# EAGLE schematic 10125623A00 (EAGLE 6.4)

## Sheet 1 of 7
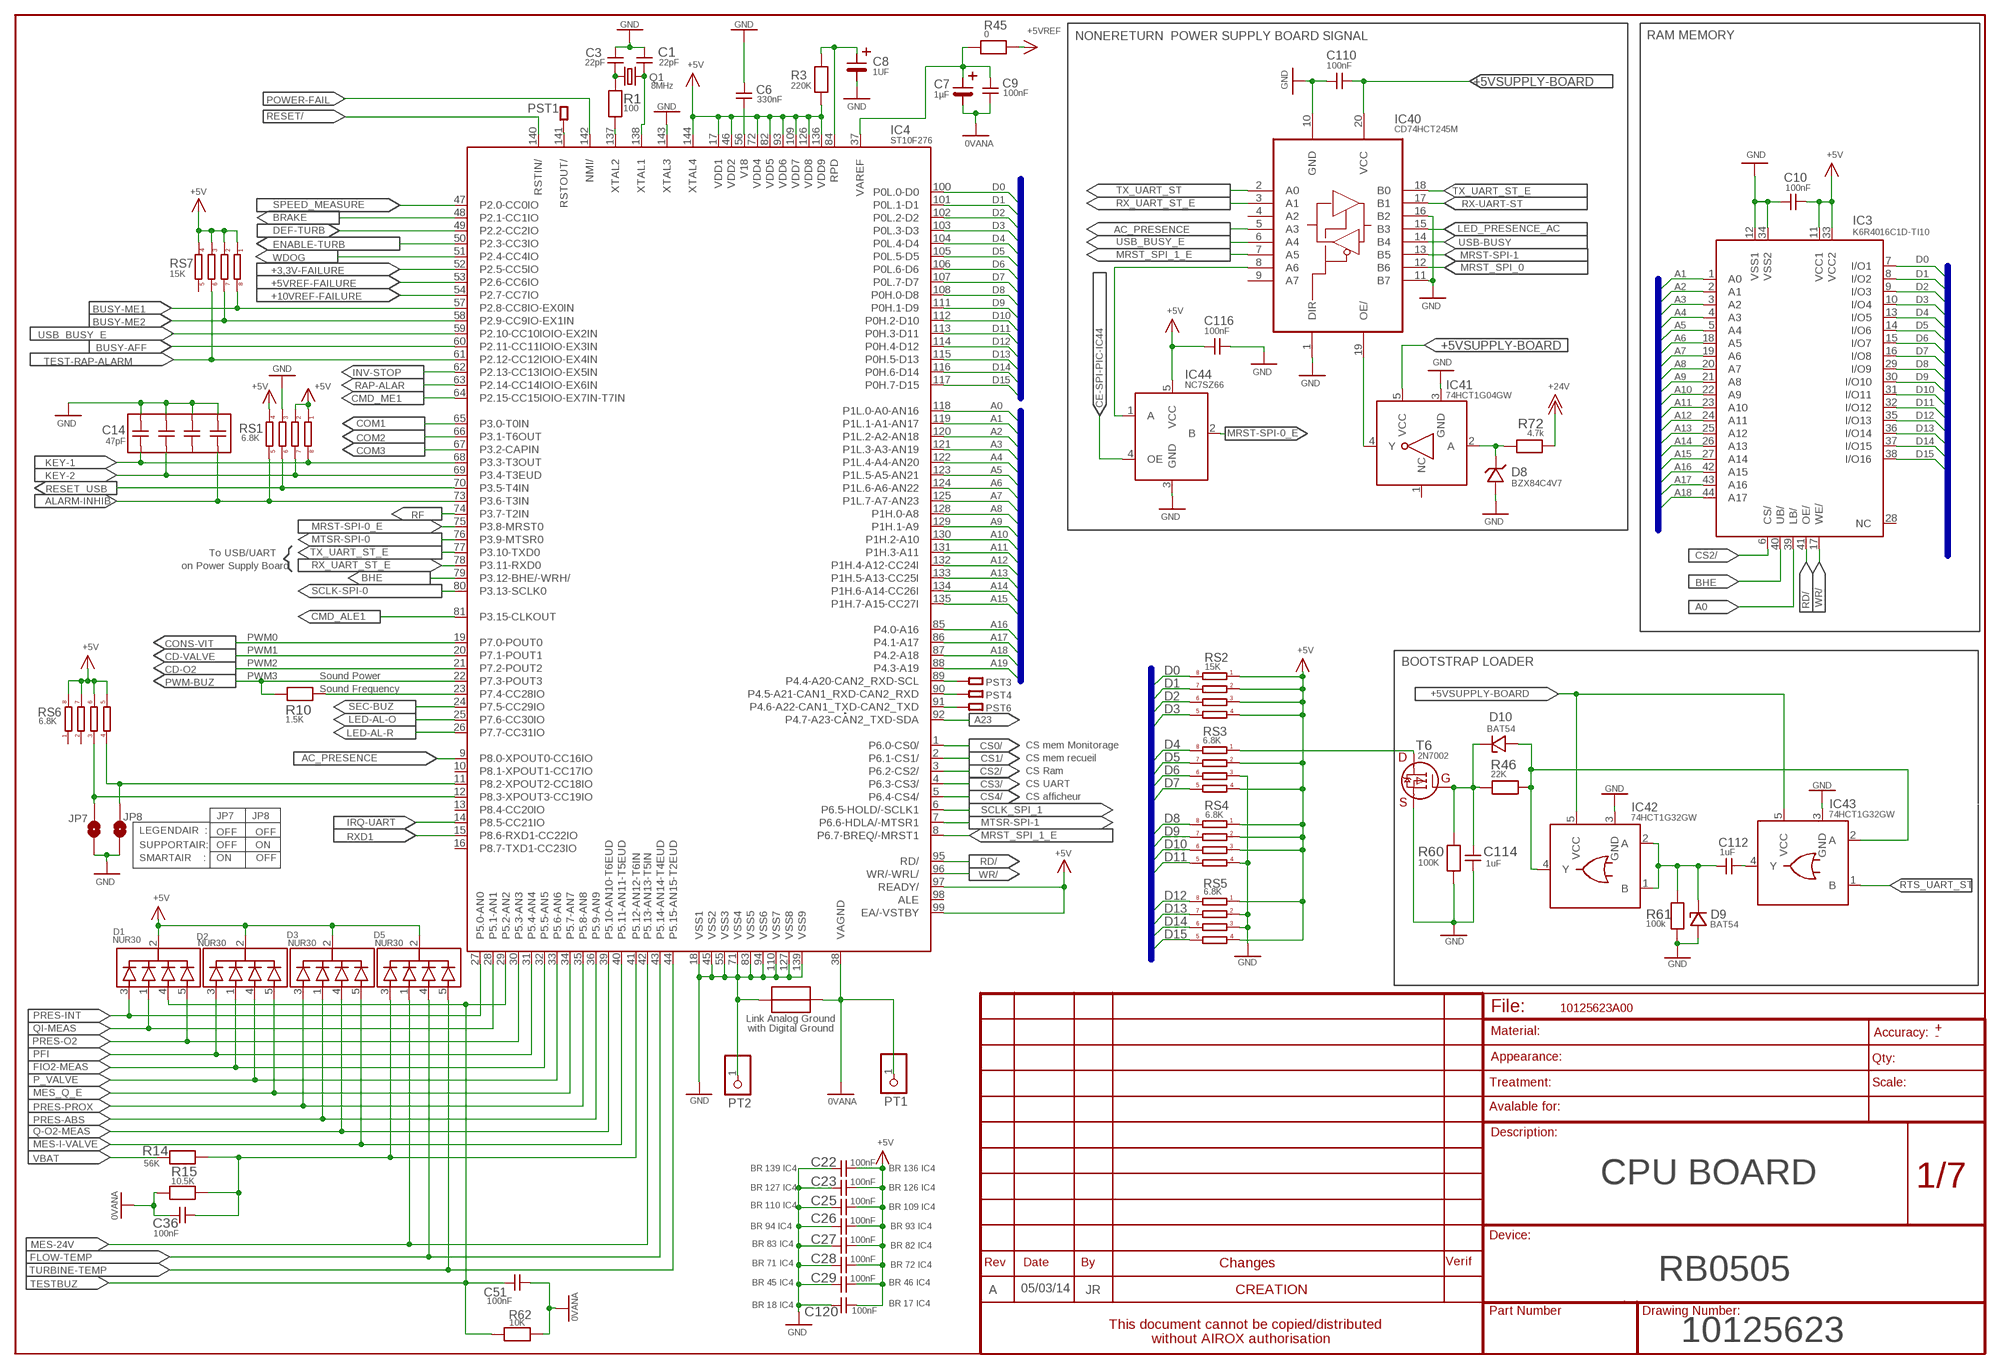
[diagram p0: schematic, sheet 1]

### Parts
C1  22pF  C0603  [C0603]
C3  22pF  C0603  [C0603]
C6  330nF  C0805  [C0805]
C7  1µF  TANTALB  [TANTALB]
C8  1UF  TANTALB  [TANTALB]
C9  100nF  C0805  [C0805]
C10  100nF  C0805  [C0805]
C14  47pF  RES_4CB  [RESEAU2]
C22  100nF  C0805  [C0805]
C23  100nF  C0805  [C0805]
C25  100nF  C0805  [C0805]
C26  100nF  C0805  [C0805]
C27  100nF  C0805  [C0805]
C28  100nF  C0805  [C0805]
C29  100nF  C0805  [C0805]
C36  100nF  C0805  [C0805]
C51  100nF  C0805  [C0805]
C110  100nF  C0805  [C0805]
C112  1uF  C0603  [C0603]
C114  1uF  C0603  [C0603]
C116  100nF  C0805  [C0805]
C120  100nF  C0805  [C0805]
D1  NUR30  [5SOT23]
D2  NUR30  [5SOT23]
D3  NUR30  [5SOT23]
D5  NUR30  [5SOT23]
D8  BZX84C4V7  BZX84CXX  [SOT23DIO]
D9  BAT54  [SOT23DIO]
D10  BAT54  [SOT23DIO]
IC3  K6R4016C1D-TI10  K6R4016C1DTCT000(256KX16)  [TSOPIIZ4]
IC4  ST10F276  ST10F269-273-276  [TQFP144]
IC40  CD74HCT245M  [SO20]
IC41  74HCT1G04GW  [SOT23-5]
IC42  74HCT1G32GW  [SOT23-5]
IC43  74HCT1G32GW  [SOT23-5]
IC44  NC7SZ66  [SOT23-5]
JP7  JUMP_0U  [0805]
JP8  JUMP_0U  [0805]
JPL1  LIAISON_MASSES  [LIAISONS_MASSES]
PST1  PAST01  [1X01]
PST3  PAST01  [1X01]
PST4  PAST01  [1X01]
PST6  PAST01  [1X01]
PT1  PINHD-1X1  [1X01]
PT2  PINHD-1X1  [1X01]
Q1  8MHz  SM49  [SM49]
R1  100  R0805  [R0805]
R3  220K  R0805  [R0805]
R10  1.5K  R0805  [R0805]
R14  56K  R0805  [R0805]
R15  10.5K  R0805  [R0805]
R45  0  R0805  [R0805]
R46  22K  R0805  [R0805]
R60  100K  R0805  [R0805]
R61  100k  R0805  [R0805]
R62  10K  R0805  [R0805]
R72  4.7k  R0805  [R0805]
RS1  6.8K  RES_4R_BCN  [BCN16_4_]
RS2  15K  RES_4R_BCN  [BCN16_4_]
RS3  6.8K  RES_4R_BCN  [BCN16_4_]
RS4  6.8K  RES_4R_BCN  [BCN16_4_]
RS5  6.8K  RES_4R_BCN  [BCN16_4_]
RS6  6.8K  RES_4R_BCN  [BCN16_4_]
RS7  15K  RES_4R_BCN  [BCN16_4_]
T6  2N7002  [SOT23MOS]

### Nets
0VANA: C7.- C9.1 C36.2 C51.2 IC4.38(VAGND) JPL1.2 PT1.1 R15.1 R62.1 ; also sheet 3,4,5,6,7
+3,3V-FAILURE: IC4.52(P2.5-CC5IO) ; also sheet 5
+5V: C10.1 C22.2 C23.2 C25.2 C26.2 C27.2 C28.2 C29.2 C116.2 C120.2 D1.2 D2.2 D3.2 D5.2 IC3.11(VCC1) IC3.33(VCC2) IC4.17(VDD1) IC4.46(VDD2) IC4.72(VDD4) IC4.82(VDD5) IC4.93(VDD6) IC4.97(READY/) IC4.99(EA/-VSTBY) IC4.109(VDD7) IC4.126(VDD8) IC4.136(VDD9) IC4.144(XTAL4) IC44.5(VCC) R3.2 RS1.1 RS1.2 RS1.4 RS2.1 RS2.2 RS2.3 RS2.4 RS3.2 RS3.4 RS4.1 RS4.2 RS4.3 RS5.1 RS5.4 RS6.5 RS6.6 RS6.7 RS6.8 RS7.1 RS7.2 RS7.3 RS7.4 ; also sheet 2,3,5,6,7
+5VREF: R45.2 ; also sheet 4,5,6
+5VREF-FAILURE: IC4.53(P2.6-CC6IO) ; also sheet 5
+5VSUPPLY-BOARD: C110.1 IC40.20(VCC) IC41.5(VCC) IC42.5(VCC) IC43.5(VCC) ; also sheet 6,7
+10VREF-FAILURE: IC4.54(P2.7-CC7IO) ; also sheet 5
+24V: R72.1 ; also sheet 3,5,6,7
A0: IC3.39(LB/) IC4.118(P1L.0-A0-AN16) ; also sheet 2,7
A1: IC3.1(A0) IC4.119(P1L.1-A1-AN17) ; also sheet 2,7
A2: IC3.2(A1) IC4.120(P1L.2-A2-AN18) ; also sheet 2,7
A3: IC3.3(A2) IC4.121(P1L.3-A3-AN19) ; also sheet 2,7
A4: IC3.4(A3) IC4.122(P1L.4-A4-AN20) ; also sheet 2
A5: IC3.5(A4) IC4.123(P1L.5-A5-AN21) ; also sheet 2
A6: IC3.18(A5) IC4.124(P1L.6-A6-AN22) ; also sheet 2
A7: IC3.19(A6) IC4.125(P1L.7-A7-AN23) ; also sheet 2
A8: IC3.20(A7) IC4.128(P1H.0-A8) ; also sheet 2
A9: IC3.21(A8) IC4.129(P1H.1-A9) ; also sheet 2
A10: IC3.22(A9) IC4.130(P1H.2-A10) ; also sheet 2
A11: IC3.23(A10) IC4.131(P1H.3-A11) ; also sheet 2
A12: IC3.24(A11) IC4.132(P1H.4-A12-CC24I) ; also sheet 2
A13: IC3.25(A12) IC4.133(P1H.5-A13-CC25I) ; also sheet 2
A14: IC3.26(A13) IC4.134(P1H.6-A14-CC26I) ; also sheet 2
A15: IC3.27(A14) IC4.135(P1H.7-A15-CC27I) ; also sheet 2
A16: IC3.42(A15) IC4.85(P4.0-A16) ; also sheet 2
A17: IC3.43(A16) IC4.86(P4.1-A17) ; also sheet 2
A18: IC3.44(A17) IC4.87(P4.2-A18) ; also sheet 2
A19: IC4.88(P4.3-A19) ; also sheet 2
A23: IC4.92(P4.7-A23-CAN2_TXD-SDA) ; also sheet 2
AC_PRESENCE: IC4.9(P8.0-XPOUT0-CC16IO) IC40.5(A3)
ALARM-INHIB: C14.8 IC4.73(P3.6-T3IN) RS1.5 ; also sheet 7
BHE: IC3.40(UB/) IC4.79(P3.12-BHE/-WRH/)
BLOAD: RS3.1 T6.D
BRAKE: IC4.48(P2.1-CC1IO) ; also sheet 6
BUSY-AFF: IC4.60(P2.11-CC11IOIO-EX3IN) ; also sheet 7
BUSY-ME1: IC4.57(P2.8-CC8IO-EX0IN) RS7.8 ; also sheet 2
BUSY-ME2: IC4.58(P2.9-CC9IO-EX1IN) RS7.7 ; also sheet 2
CD-O2: IC4.21(P7.2-POUT2) ; also sheet 3
CD-VALVE: IC4.20(P7.1-POUT1) ; also sheet 3
CE-SPI-PIC-IC44: IC44.4(OE) ; also sheet 2
CMD_ALE1: IC4.81(P3.15-CLKOUT) ; also sheet 2
CMD_ME1: IC4.64(P2.15-CC15IOIO-EX7IN-T7IN) ; also sheet 2
COM1: IC4.65(P3.0-T0IN) ; also sheet 7
COM2: IC4.66(P3.1-T6OUT) ; also sheet 7
COM3: IC4.67(P3.2-CAPIN) ; also sheet 7
CONS-VIT: IC4.19(P7.0-POUT0) ; also sheet 6
CS0/: IC4.1(P6.0-CS0/) ; also sheet 2
CS1/: IC4.2(P6.1-CS1/) ; also sheet 2
CS2/: IC3.6(CS/) IC4.3(P6.2-CS2/)
CS3/: IC4.4(P6.3-CS3/) ; also sheet 2
CS4/: IC4.5(P6.4-CS4/) ; also sheet 7
D0: IC3.7(I/O1) IC4.100(P0L.0-D0) RS2.8 ; also sheet 2,7
D1: IC3.8(I/O2) IC4.101(P0L.1-D1) RS2.7 ; also sheet 2,7
D2: IC3.9(I/O3) IC4.102(P0L.2-D2) RS2.6 ; also sheet 2,7
D3: IC3.10(I/O4) IC4.103(P0L.3-D3) RS2.5 ; also sheet 2,7
D4: IC3.13(I/O5) IC4.104(P0L.4-D4) RS3.8 ; also sheet 2,7
D5: IC3.14(I/O6) IC4.105(P0L.5-D5) RS3.7 ; also sheet 2,7
D6: IC3.15(I/O7) IC4.106(P0L.6-D6) RS3.6 ; also sheet 2,7
D7: IC3.16(I/O8) IC4.107(P0L.7-D7) RS3.5 ; also sheet 2,7
D8: IC3.29(I/O9) IC4.108(P0H.0-D8) RS4.8 ; also sheet 2
D9: IC3.30(I/O10) IC4.111(P0H.1-D9) RS4.7 ; also sheet 2
D10: IC3.31(I/O11) IC4.112(P0H.2-D10) RS4.6 ; also sheet 2
D11: IC3.32(I/O12) IC4.113(P0H.3-D11) RS4.5 ; also sheet 2
D12: IC3.35(I/O13) IC4.114(P0H.4-D12) RS5.8 ; also sheet 2
D13: IC3.36(I/O14) IC4.115(P0H.5-D13) RS5.7 ; also sheet 2
D14: IC3.37(I/O15) IC4.116(P0H.6-D14) RS5.6 ; also sheet 2
D15: IC3.38(I/O16) IC4.117(P0H.7-D15) RS5.5 ; also sheet 2
DEF-TURB: IC4.49(P2.2-CC2IO) ; also sheet 6
ENABLE-TURB: IC4.50(P2.3-CC3IO) ; also sheet 6
FIO2-MEAS: D2.1 IC4.32(P5.5-AN5) ; also sheet 3
FLOW-TEMP: D5.4 IC4.43(P5.14-AN14-T4EUD) ; also sheet 6
GND: C1.2 C3.2 C6.2 C8.- C10.2 C14.1 C14.2 C14.3 C14.4 C22.1 C23.1 C25.1 C26.1 C27.1 C28.1 C29.1 C110.2 C114.1 C116.1 C120.1 D8.1(A) D9.1(A) IC3.12(VSS1) IC3.34(VSS2) IC4.18(VSS1) IC4.45(VSS2) IC4.55(VSS3) IC4.71(VSS4) IC4.83(VSS5) IC4.94(VSS6) IC4.110(VSS7) IC4.127(VSS8) IC4.139(VSS9) IC4.143(XTAL3) IC40.1(DIR) IC40.10(GND) IC40.11(B7) IC40.16(B2) IC41.3(GND) IC42.3(GND) IC43.3(GND) IC44.3(GND) JP7.1 JP8.1 JPL1.1 PT2.1 R60.1 R61.2 RS1.3 RS3.3 RS4.4 RS5.2 RS5.3 T6.S ; also sheet 2,3,5,6,7
INV-STOP: IC4.62(P2.13-CC13IOIO-EX5IN) ; also sheet 6
IRQ-UART: IC4.14(P8.5-CC21IO) ; also sheet 2
KEY-1: C14.5 IC4.68(P3.3-T3OUT) RS1.8 ; also sheet 7
KEY-2: C14.6 IC4.69(P3.4-T3EUD) RS1.7 ; also sheet 7
LED-AL-O: IC4.25(P7.6-CC30IO) ; also sheet 7
LED-AL-R: IC4.26(P7.7-CC31IO) ; also sheet 7
LED_PRESENCE_AC: IC40.15(B3) ; also sheet 7
MES-24V: D5.1 IC4.42(P5.13-AN13-T5IN) ; also sheet 5
MES-I-VALVE: D3.5 IC4.40(P5.11-AN11-T5EUD) ; also sheet 3
MES_Q_E: D2.5 IC4.34(P5.7-AN7) ; also sheet 4
MRST-SPI-0_E: IC4.75(P3.8-MRST0) IC44.2(B) ; also sheet 2,3,4
MRST-SPI-1: IC40.13(B5) ; also sheet 7
MRST_SPI_0: IC40.12(B6) ; also sheet 7
MRST_SPI_1_E: IC4.8(P6.7-BREQ/-MRST1) IC40.7(A5)
MTSR-SPI-0: IC4.76(P3.9-MTSR0) ; also sheet 2,3,4,7
MTSR-SPI-1: IC4.7(P6.6-HDLA/-MTSR1) ; also sheet 7
N$3: C3.1 Q1.1 R1.1
N$4: IC4.137(XTAL2) R1.2
N$11: C8.+ IC4.84(RPD) R3.1
N$20: IC4.23(P7.4-CC28IO) R10.2
N$41: IC4.141(RSTOUT/) PST1.1
N$55: IC4.89(P4.4-A20-CAN2_RXD-SCL) PST3.1
N$56: IC4.90(P4.5-A21-CAN1_RXD-CAN2_RXD) PST4.1
N$57: IC4.91(P4.6-A22-CAN1_TXD-CAN2_TXD) PST6.1
N$64: C7.+ C9.2 IC4.37(VAREF) R45.1
N$76: C1.1 IC4.138(XTAL1) Q1.2
N$84: IC4.11(P8.2-XPOUT2-CC18IO) JP8.2 RS6.4
N$86: C36.1 D5.3 IC4.41(P5.12-AN12-T6IN) R14.2 R15.2
N$88: IC4.12(P8.3-XPOUT3-CC19IO) JP7.2 RS6.3
N$92: D10.1(A) IC42.4(Y) IC43.2(A) R46.2
N$96: IC40.19(OE/) IC41.4(Y)
N$99: D8.3(K) IC41.2(A) R72.2
N$100: C112.2 IC43.4(Y)
N$102: C112.1 D9.3(K) IC42.1(B) IC42.2(A) R61.1
N$106: IC40.8(A6) IC44.1(A)
N$111: C6.1 IC4.56(V18)
N$121: C114.2 D10.3(K) R46.1 R60.2 T6.G
P_VALVE: D2.4 IC4.33(P5.6-AN6) ; also sheet 4
PFI: D2.3 IC4.31(P5.4-AN4) ; also sheet 3
POWER-FAIL: IC4.142(NMI/) ; also sheet 3
PRES-ABS: D3.1 IC4.36(P5.9-AN9) ; also sheet 4
PRES-INT: D1.3 IC4.27(P5.0-AN0) ; also sheet 4
PRES-O2: D1.5 IC4.30(P5.3-AN3) ; also sheet 4
PRES-PROX: D3.3 IC4.35(P5.8-AN8) ; also sheet 4
PWM-BUZ: IC4.22(P7.3-POUT3) R10.1 ; also sheet 6
Q-O2-MEAS: D3.4 IC4.39(P5.10-AN10-T6EUD) ; also sheet 6
QI-MEAS: D1.1 IC4.28(P5.1-AN1) ; also sheet 4
RAP-ALAR: IC4.63(P2.14-CC14IOIO-EX6IN) ; also sheet 6
RD/: IC3.41(OE/) IC4.95(RD/) ; also sheet 2,7
RESET/: IC4.140(RSTIN/) ; also sheet 2,3
RESET_USB: IC4.70(P3.5-T4IN) RS1.6 ; also sheet 7
RF: IC4.74(P3.7-T2IN) ; also sheet 6
RTS_UART_ST: IC43.1(B) ; also sheet 7
RX-UART-ST: IC40.17(B1) ; also sheet 7
RX_UART_ST_E: IC4.78(P3.11-RXD0) IC40.3(A1)
RXD1: IC4.15(P8.6-RXD1-CC22IO) ; also sheet 7
SCLK-SPI-0: IC4.80(P3.13-SCLK0) ; also sheet 2,3,4,7
SCLK_SPI_1: IC4.6(P6.5-HOLD/-SCLK1) ; also sheet 7
SEC-BUZ: IC4.24(P7.5-CC29IO) ; also sheet 3
SPEED_MEASURE: IC4.47(P2.0-CC0IO) ; also sheet 6
TEST-RAP-ALARM: IC4.61(P2.12-CC12IOIO-EX4IN) RS7.6 ; also sheet 6
TESTBUZ: C51.1 D1.4 IC4.29(P5.2-AN2) R62.2 ; also sheet 6
TURBINE-TEMP: D5.5 IC4.44(P5.15-AN15-T2EUD) ; also sheet 6
TX_UART_ST: IC40.2(A0) ; also sheet 7
TX_UART_ST_E: IC4.77(P3.10-TXD0) IC40.18(B0)
USB-BUSY: IC40.14(B4) ; also sheet 7
USB_BUSY_E: IC4.59(P2.10-CC10IOIO-EX2IN) IC40.6(A4)
VBAT: R14.1 ; also sheet 7
WDOG: IC4.51(P2.4-CC4IO) ; also sheet 3
WR/: IC3.17(WE/) IC4.96(WR/-WRL/) ; also sheet 2,7
Unconnected: C14.7 IC3.28(NC) IC4.10(P8.1-XPOUT1-CC17IO) IC4.13(P8.4-CC20IO) IC4.16(P8.7-TXD1-CC23IO) IC4.98(ALE) IC40.4(A2) IC40.9(A7) IC41.1(NC) RS6.1 RS6.2 RS7.5

### Buses
D[0..15]
A[0..23]

### Notes on the sheet
- NONERETURN  POWER SUPPLY BOARD SIGNAL | RAM MEMORY
- To USB/UART
- on Power Supply Board
- PWM0
- PWM1
- PWM2 | BOOTSTRAP LOADER
- PWM3 | Sound Power
- Sound Frequency
- CS mem Monitorage
- CS mem recueil
- CS Ram
- CS UART
- CS afficheur
- JP7      JP8
- LEGENDAIR  : | OFF      OFF
- SUPPORTAIR: | OFF      ON
- SMARTAIR    : | ON        OFF
- Link Analog Ground
- with Digital Ground
- BR 139 IC4 | BR 136 IC4
- CPU BOARD
- BR 127 IC4 | BR 126 IC4
- BR 110 IC4 | BR 109 IC4
- BR 94 IC4 | BR 93 IC4
- BR 83 IC4 | BR 82 IC4
- BR 71 IC4 | BR 72 IC4
- RB0505
- BR 45 IC4 | BR 46 IC4
- A | 05/03/14 | JR
- BR 18 IC4 | BR 17 IC4
- 10125623

## Sheet 2 of 7
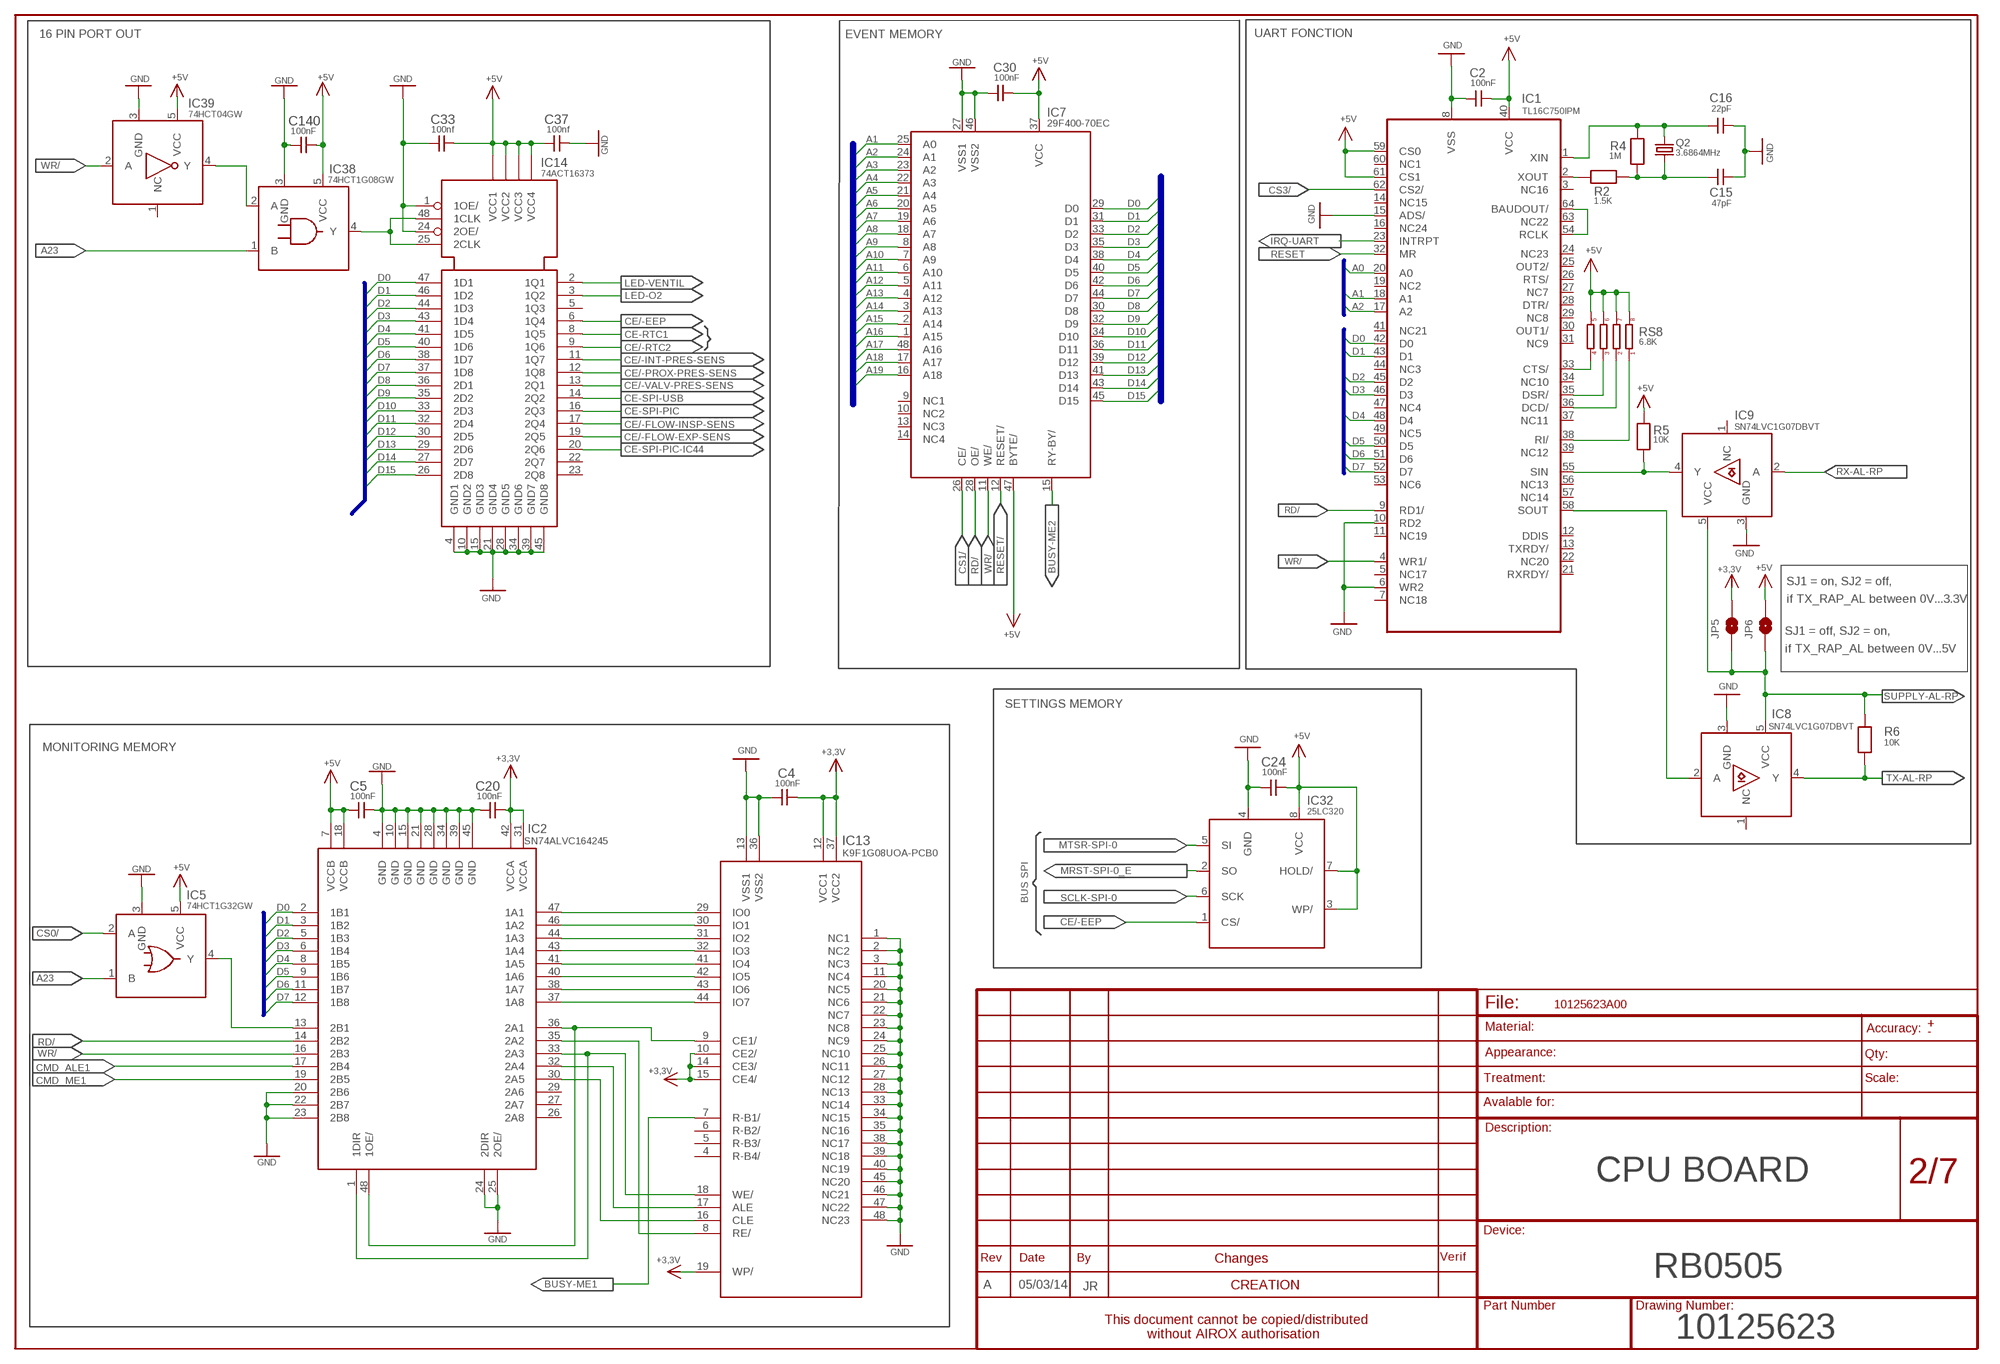
[diagram p1: schematic, sheet 2]

### Parts
C2  100nF  C0805  [C0805]
C4  100nF  C0805  [C0805]
C5  100nF  C0603  [C0603]
C15  47pF  C0805  [C0805]
C16  22pF  C0805  [C0805]
C20  100nF  C0603  [C0603]
C24  100nF  C0805  [C0805]
C30  100nF  C0805  [C0805]
C33  100nf  C0805  [C0805]
C37  100nf  C0805  [C0805]
C140  100nF  C0805  [C0805]
IC1  TL16C750IPM  [TQFP64]
IC2  SN74ALVC164245  [TSSOP48]
IC5  74HCT1G32GW  [SOT23-5]
IC7  Am29F400-EC  29F800  [TS048]
IC8  SN74LVC1G07DBVT  LVC1G07DBVT  [SOT753_DBV]
IC9  SN74LVC1G07DBVT  LVC1G07DBVT  [SOT753_DBV]
IC13  K9F1G08UOA-PCB0  K9F4G08U0M-PCB000  [TS048]
IC14  74ACT16373  [TSSOP48]
IC32  25LC320  AT25---  [SOIC8]
IC38  74HCT1G08GW  [SOT23-5]
IC39  74HCT04GW  74HCT1G04GW  [SOT23-5]
JP5  JUMP_0U  [0805]
JP6  JUMP_0U  [0805]
Q2  3.6864MHz  HC49UP  [HC49UP]
R2  1.5K  R0805  [R0805]
R4  1M  R0805  [R0805]
R5  10K  R0805  [R0805]
R6  10K  R0805  [R0805]
RS8  6.8K  RES_4R_BCN  [BCN16_4_]

### Nets
+3,3V: C4.1 C20.1 IC2.31(VCCA) IC2.42(VCCA) IC13.10(CE2/) IC13.12(VCC1) IC13.14(CE3/) IC13.15(CE4/) IC13.19(WP/) IC13.37(VCC2) JP5.2 ; also sheet 5,6,7
+5V: C2.1 C5.2 C24.1 C30.1 C33.1 C37.2 C140.2 IC1.40(VCC) IC1.59(CS0) IC1.61(CS1) IC2.7(VCCB) IC2.18(VCCB) IC5.5(VCC) IC7.37(VCC) IC7.47(BYTE/) IC14.7(VCC1) IC14.18(VCC2) IC14.31(VCC3) IC14.42(VCC4) IC32.3(WP/) IC32.7(HOLD/) IC32.8(VCC) IC38.5(VCC) IC39.5(VCC) JP6.2 R5.2 RS8.5 RS8.6 RS8.7 RS8.8 ; also sheet 1,3,5,6,7
A0: IC1.20(A0) ; also sheet 1,7
A1: IC1.18(A1) IC7.25(A0) ; also sheet 1,7
A2: IC1.17(A2) IC7.24(A1) ; also sheet 1,7
A3: IC7.23(A2) ; also sheet 1,7
A4: IC7.22(A3) ; also sheet 1
A5: IC7.21(A4) ; also sheet 1
A6: IC7.20(A5) ; also sheet 1
A7: IC7.19(A6) ; also sheet 1
A8: IC7.18(A7) ; also sheet 1
A9: IC7.8(A8) ; also sheet 1
A10: IC7.7(A9) ; also sheet 1
A11: IC7.6(A10) ; also sheet 1
A12: IC7.5(A11) ; also sheet 1
A13: IC7.4(A12) ; also sheet 1
A14: IC7.3(A13) ; also sheet 1
A15: IC7.2(A14) ; also sheet 1
A16: IC7.1(A15) ; also sheet 1
A17: IC7.48(A16) ; also sheet 1
A18: IC7.17(A17) ; also sheet 1
A19: IC7.16(A18) ; also sheet 1
A23: IC5.1(B) IC38.1(B) ; also sheet 1
BUSY-ME1: IC13.7(R-B1/) ; also sheet 1
BUSY-ME2: IC7.15(RY-BY/) ; also sheet 1
CE-RTC1: IC14.8(1Q5) ; also sheet 3
CE-SPI-PIC: IC14.16(2Q3) ; also sheet 7
CE-SPI-PIC-IC44: IC14.20(2Q6) ; also sheet 1
CE-SPI-USB: IC14.14(2Q2) ; also sheet 7
CE/-EEP: IC14.6(1Q4) IC32.1(CS/)
CE/-FLOW-EXP-SENS: IC14.19(2Q5) ; also sheet 4
CE/-FLOW-INSP-SENS: IC14.17(2Q4) ; also sheet 4
CE/-INT-PRES-SENS: IC14.11(1Q7) ; also sheet 4
CE/-PROX-PRES-SENS: IC14.12(1Q8) ; also sheet 4
CE/-RTC2: IC14.9(1Q6) ; also sheet 3
CE/-VALV-PRES-SENS: IC14.13(2Q1) ; also sheet 4
CMD_ALE1: IC2.17(2B4) ; also sheet 1
CMD_ME1: IC2.19(2B5) ; also sheet 1
CS0/: IC5.2(A) ; also sheet 1
CS1/: IC7.26(CE/) ; also sheet 1
CS3/: IC1.62(CS2/) ; also sheet 1
D0: IC1.42(D0) IC2.2(1B1) IC7.29(D0) IC14.47(1D1) ; also sheet 1,7
D1: IC1.43(D1) IC2.3(1B2) IC7.31(D1) IC14.46(1D2) ; also sheet 1,7
D2: IC1.45(D2) IC2.5(1B3) IC7.33(D2) IC14.44(1D3) ; also sheet 1,7
D3: IC1.46(D3) IC2.6(1B4) IC7.35(D3) IC14.43(1D4) ; also sheet 1,7
D4: IC1.48(D4) IC2.8(1B5) IC7.38(D4) IC14.41(1D5) ; also sheet 1,7
D5: IC1.50(D5) IC2.9(1B6) IC7.40(D5) IC14.40(1D6) ; also sheet 1,7
D6: IC1.51(D6) IC2.11(1B7) IC7.42(D6) IC14.38(1D7) ; also sheet 1,7
D7: IC1.52(D7) IC2.12(1B8) IC7.44(D7) IC14.37(1D8) ; also sheet 1,7
D8: IC7.30(D8) IC14.36(2D1) ; also sheet 1
D9: IC7.32(D9) IC14.35(2D2) ; also sheet 1
D10: IC7.34(D10) IC14.33(2D3) ; also sheet 1
D11: IC7.36(D11) IC14.32(2D4) ; also sheet 1
D12: IC7.39(D12) IC14.30(2D5) ; also sheet 1
D13: IC7.41(D13) IC14.29(2D6) ; also sheet 1
D14: IC7.43(D14) IC14.27(2D7) ; also sheet 1
D15: IC7.45(D15) IC14.26(2D8) ; also sheet 1
GND: C2.2 C4.2 C5.1 C15.2 C16.1 C20.2 C24.2 C30.2 C33.2 C37.1 C140.1 IC1.6(WR2) IC1.8(VSS) IC1.10(RD2) IC1.15(ADS/) IC2.4(GND) IC2.10(GND) IC2.15(GND) IC2.20(2B6) IC2.21(GND) IC2.22(2B7) IC2.23(2B8) IC2.24(2DIR) IC2.25(2OE/) IC2.28(GND) IC2.34(GND) IC2.39(GND) IC2.45(GND) IC5.3(GND) IC7.27(VSS1) IC7.46(VSS2) IC8.3(GND) IC9.3(GND) IC13.1(NC1) IC13.2(NC2) IC13.3(NC3) IC13.11(NC4) IC13.13(VSS1) IC13.20(NC5) IC13.21(NC6) IC13.22(NC7) IC13.23(NC8) IC13.24(NC9) IC13.25(NC10) IC13.26(NC11) IC13.27(NC12) IC13.28(NC13) IC13.33(NC14) IC13.34(NC15) IC13.35(NC16) IC13.36(VSS2) IC13.38(NC17) IC13.39(NC18) IC13.40(NC19) IC13.45(NC20) IC13.46(NC21) IC13.47(NC22) IC13.48(NC23) IC14.1(1OE/) IC14.4(GND1) IC14.10(GND2) IC14.15(GND3) IC14.21(GND4) IC14.24(2OE/) IC14.28(GND5) IC14.34(GND6) IC14.39(GND7) IC14.45(GND8) IC32.4(GND) IC38.3(GND) IC39.3(GND) ; also sheet 1,3,5,6,7
IRQ-UART: IC1.23(INTRPT) ; also sheet 1
LED-O2: IC14.3(1Q2) ; also sheet 7
LED-VENTIL: IC14.2(1Q1) ; also sheet 7
MRST-SPI-0_E: IC32.2(SO) ; also sheet 1,3,4
MTSR-SPI-0: IC32.5(SI) ; also sheet 1,3,4,7
N$8: IC2.47(1A1) IC13.29(IO0)
N$10: IC38.2(A) IC39.4(Y)
N$12: C16.2 IC1.1(XIN) Q2.1 R4.2
N$13: IC2.13(2B1) IC5.4(Y)
N$14: IC14.25(2CLK) IC14.48(1CLK) IC38.4(Y)
N$27: C15.1 Q2.2 R2.2 R4.1
N$29: IC1.2(XOUT) R2.1
N$31: IC1.54(RCLK) IC1.64(BAUDOUT/)
N$35: IC2.36(2A1) IC2.48(1OE/) IC13.9(CE1/)
N$53: IC2.46(1A2) IC13.30(IO1)
N$63: IC2.44(1A3) IC13.31(IO2)
N$65: IC2.43(1A4) IC13.32(IO3)
N$69: IC1.33(CTS/) RS8.4
N$73: IC1.35(DSR/) RS8.3
N$74: IC1.36(DCD/) RS8.2
N$77: IC1.38(RI/) RS8.1
N$79: IC1.58(SOUT) IC8.2(A)
N$80: IC2.41(1A5) IC13.41(IO4)
N$85: IC2.40(1A6) IC13.42(IO5)
N$89: IC2.35(2A2) IC13.8(RE/)
N$90: IC2.32(2A4) IC13.17(ALE)
N$91: IC2.30(2A5) IC13.16(CLE)
N$94: IC2.38(1A7) IC13.43(IO6)
N$95: IC2.37(1A8) IC13.44(IO7)
N$101: IC2.1(1DIR) IC2.33(2A3) IC13.18(WE/)
RD/: IC1.9(RD1/) IC2.14(2B2) IC7.28(OE/) ; also sheet 1,7
RESET: IC1.32(MR) ; also sheet 3
RESET/: IC7.12(RESET/) ; also sheet 1,3
RX-AL-RP: IC9.2(A) ; also sheet 6
RXD2: IC1.55(SIN) IC9.4(Y) R5.1
SCLK-SPI-0: IC32.6(SCK) ; also sheet 1,3,4,7
SUPPLY-AL-RP: IC8.5(VCC) IC9.5(VCC) JP5.1 JP6.1 R6.2 ; also sheet 6
TX-AL-RP: IC8.4(Y) R6.1 ; also sheet 6
WR/: IC1.4(WR1/) IC2.16(2B3) IC7.11(WE/) IC39.2(A) ; also sheet 1,7
Unconnected: IC1.3(NC16) IC1.5(NC17) IC1.7(NC18) IC1.11(NC19) IC1.12(DDIS) IC1.13(TXRDY/) IC1.14(NC15) IC1.16(NC24) IC1.19(NC2) IC1.21(RXRDY/) IC1.22(NC20) IC1.24(NC23) IC1.25(OUT2/) IC1.26(RTS/) IC1.27(NC7) IC1.28(DTR/) IC1.29(NC8) IC1.30(OUT1/) IC1.31(NC9) IC1.34(NC10) IC1.37(NC11) IC1.39(NC12) IC1.41(NC21) IC1.44(NC3) IC1.47(NC4) IC1.49(NC5) IC1.53(NC6) IC1.56(NC13) IC1.57(NC14) IC1.60(NC1) IC1.63(NC22) IC2.26(2A8) IC2.27(2A7) IC2.29(2A6) IC7.9(NC1) IC7.10(NC2) IC7.13(NC3) IC7.14(NC4) IC8.1(NC) IC9.1(NC) IC13.4(R-B4/) IC13.5(R-B3/) IC13.6(R-B2/) IC14.5(1Q3) IC14.22(2Q7) IC14.23(2Q8) IC39.1(NC)

### Buses
D[0..15]
A[0..23]

### Notes on the sheet
- 16 PIN PORT OUT | EVENT MEMORY | UART FONCTION
- 29F400-70EC
- SJ1 = on, SJ2 = off,
- if TX_RAP_AL between 0V...3.3V
- SJ1 = off, SJ2 = on,
- if TX_RAP_AL between 0V...5V
- SETTINGS MEMORY
- MONITORING MEMORY
- BUS SPI
- CPU BOARD
- RB0505
- A | 05/03/14 | JR
- 10125623

## Sheet 3 of 7
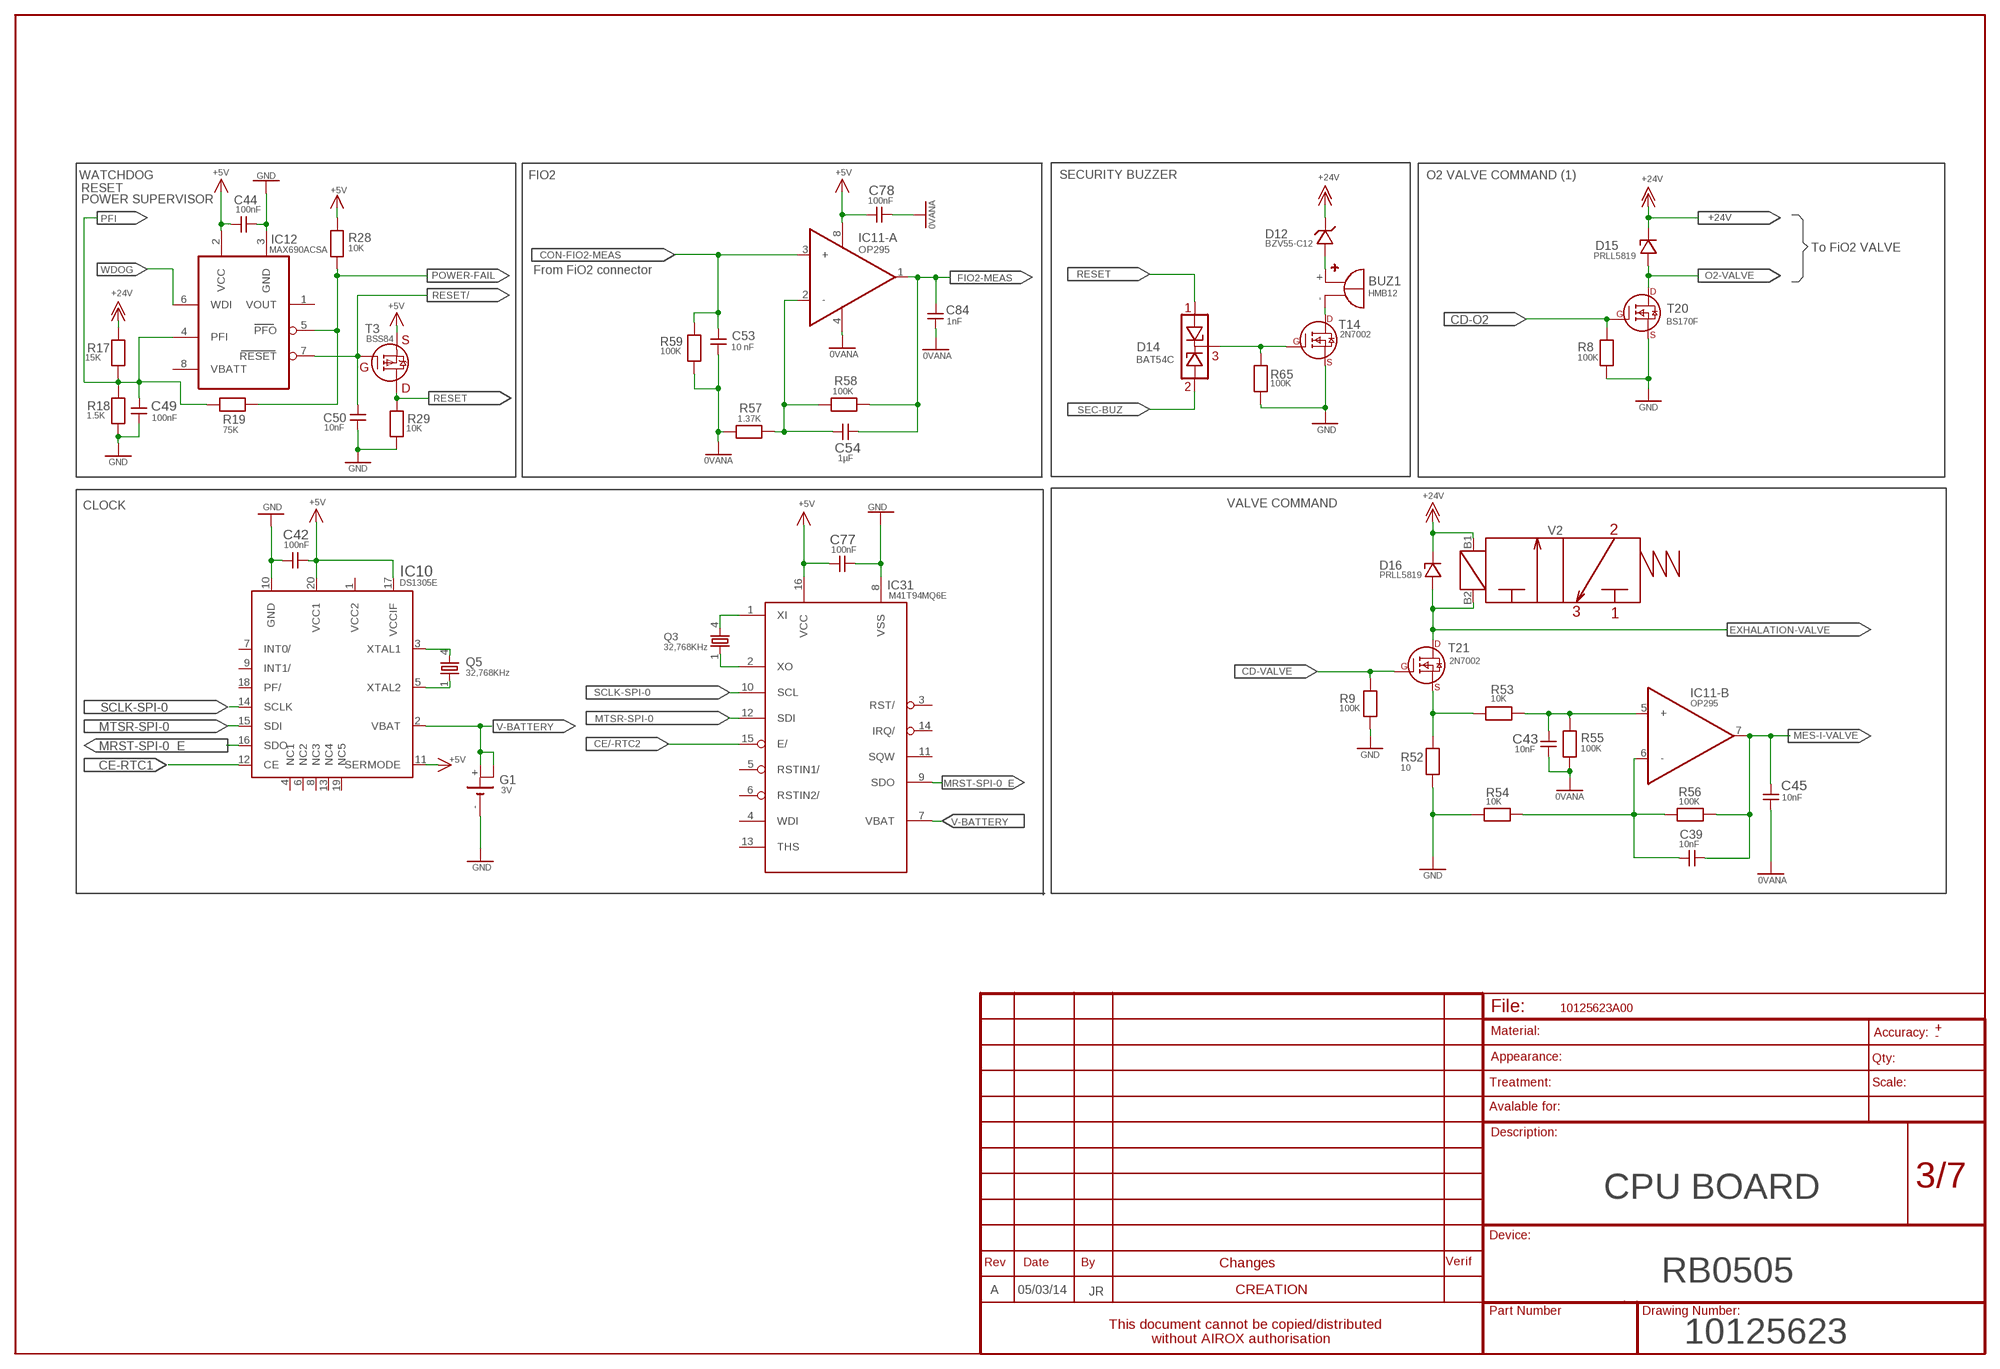
[diagram p2: schematic, sheet 3]

### Parts
BUZ1  HMB12  F/HMB  [F/HMB]
C39  10nF  C0805  [C0805]
C42  100nF  C0805  [C0805]
C43  10nF  C0805  [C0805]
C44  100nF  C0805  [C0805]
C45  10nF  C0805  [C0805]
C49  100nF  C0805  [C0805]
C50  10nF  C0805  [C0805]
C53  10 nF  C0805  [C0805]
C54  1µF  C0805  [C0805]
C77  100nF  C0805  [C0805]
C78  100nF  C0805  [C0805]
C84  1nF  C0805  [C0805]
D12  BZV55-C12  BZX84CXX  [SOT23DIO]
D14  BAT54C  [SOT23_DI]
D15  PRLL5819  [SOD87]
D16  PRLL5819  [SOD87]
G1  3V  KEY_3000  [KEY_3000]
IC10  DS1305E  [TSSOP20]
IC11  OP295  LM358  [SO8]
IC12  MAX690ACSA  [SO08]
IC31  M41T94MQ6E  [SO16]
Q3  32,768KHz  86SMX  [86SMX]
Q5  32,768KHz  86SMX  [86SMX]
R8  100K  R0805  [R0805]
R9  100K  R0805  [R0805]
R17  15K  R0805  [R0805]
R18  1.5K  R0805  [R0805]
R19  75K  R0805  [R0805]
R28  10K  R0805  [R0805]
R29  10K  R0805  [R0805]
R52  10  R0805  [R0805]
R53  10K  R0805  [R0805]
R54  10K  R0805  [R0805]
R55  100K  R0805  [R0805]
R56  100K  R0805  [R0805]
R57  1.37K  R0805  [R0805]
R58  100K  R0805  [R0805]
R59  100K  R0805  [R0805]
R65  100K  R0805  [R0805]
T3  BSS84  IRLML5103  [SOT23MOS]
T14  2N7002  MTD3055  [DPAK]
T20  BS170F  MTD3055  [DPAK]
T21  2N7002  MTD3055  [DPAK]
V2  FAS-PPS-1P-3NIP-INJ  [FAS-PPS-1P-3NIP-INJ]

### Nets
0VANA: C43.1 C45.1 C53.1 C78.1 C84.1 IC11.4(W:GND) R55.1 R57.1 R59.1 ; also sheet 1,4,5,6,7
+5V: C42.1 C44.1 C77.2 C78.2 IC10.11(SERMODE) IC10.17(VCCIF) IC10.20(VCC1) IC11.8(W:VCC) IC12.2(VCC) IC31.16(VCC) R28.2 T3.S ; also sheet 1,2,5,6,7
+24V: D12.3(K) D15.K D16.K R17.2 V2.B1 ; also sheet 1,5,6,7
CD-O2: R8.2 T20.G(GATE) ; also sheet 1
CD-VALVE: R9.2 T21.G(GATE) ; also sheet 1
CE-RTC1: IC10.12(CE) ; also sheet 2
CE/-RTC2: IC31.15(E/) ; also sheet 2
CON-FIO2-MEAS: C53.2 IC11.3(-A:+) R59.2 ; also sheet 6
EXHALATION-VALVE: D16.A T21.D(DRAIN) V2.B2 ; also sheet 6
FIO2-MEAS: C54.2 C84.2 IC11.1(-A:OUT) R58.2 ; also sheet 1
GND: C42.2 C44.2 C49.1 C50.1 C77.1 G1.- IC10.10(GND) IC12.3(GND) IC31.8(VSS) R8.1 R9.1 R18.1 R29.2 R52.1 R54.1 R65.1 T14.S(SOURCE) T20.S(SOURCE) ; also sheet 1,2,5,6,7
IC11-B: C39.2 IC11.6(-B:-) R54.2 R56.2
MES-I-VALVE: C39.1 C45.2 IC11.7(-B:OUT) R56.1 ; also sheet 1
MRST-SPI-0_E: IC10.16(SDO) IC31.9(SDO) ; also sheet 1,2,4
MTSR-SPI-0: IC10.15(SDI) IC31.12(SDI) ; also sheet 1,2,4,7
N$6: C54.1 IC11.2(-A:-) R57.2 R58.1
N$9: BUZ1.+ D12.1(A)
N$16: IC10.3(XTAL1) Q5.4
N$32: IC10.5(XTAL2) Q5.1
N$34: IC31.1(XI) Q3.4
N$45: IC31.2(XO) Q3.1
N$66: R52.2 R53.1 T21.S(SOURCE)
N$67: C43.2 IC11.5(-B:+) R53.2 R55.2
N$68: BUZ1.- T14.D(DRAIN)
N$82: D14.3 R65.2 T14.G(GATE)
O2-VALVE: D15.A T20.D(DRAIN) ; also sheet 6
PFI: C49.2 IC12.4(PFI) R17.1 R18.2 R19.1 ; also sheet 1
POWER-FAIL: IC12.5(PFO) R19.2 R28.1 ; also sheet 1
RESET: D14.1 R29.1 T3.D ; also sheet 2
RESET/: C50.2 IC12.7(RESET) T3.G ; also sheet 1,2
SCLK-SPI-0: IC10.14(SCLK) IC31.10(SCL) ; also sheet 1,2,4,7
SEC-BUZ: D14.2 ; also sheet 1
V-BATTERY: G1.+ G1.PLUS IC10.2(VBAT) IC31.7(VBAT)
WDOG: IC12.6(WDI) ; also sheet 1
Unconnected: IC10.1(VCC2) IC10.4(NC1) IC10.6(NC2) IC10.7(INT0/) IC10.8(NC3) IC10.9(INT1/) IC10.13(NC4) IC10.18(PF/) IC10.19(NC5) IC12.1(VOUT) IC12.8(VBATT) IC31.3(RST/) IC31.4(WDI) IC31.5(RSTIN1/) IC31.6(RSTIN2/) IC31.11(SQW) IC31.13(THS) IC31.14(IRQ/)

### Notes on the sheet
- WATCHDOG | FIO2 | SECURITY BUZZER | O2 VALVE COMMAND (1)
- RESET
- POWER SUPERVISOR
- To FiO2 VALVE
- From FiO2 connector
- CLOCK | VALVE COMMAND
- CPU BOARD
- RB0505
- A | 05/03/14 | JR
- 10125623

## Sheet 4 of 7
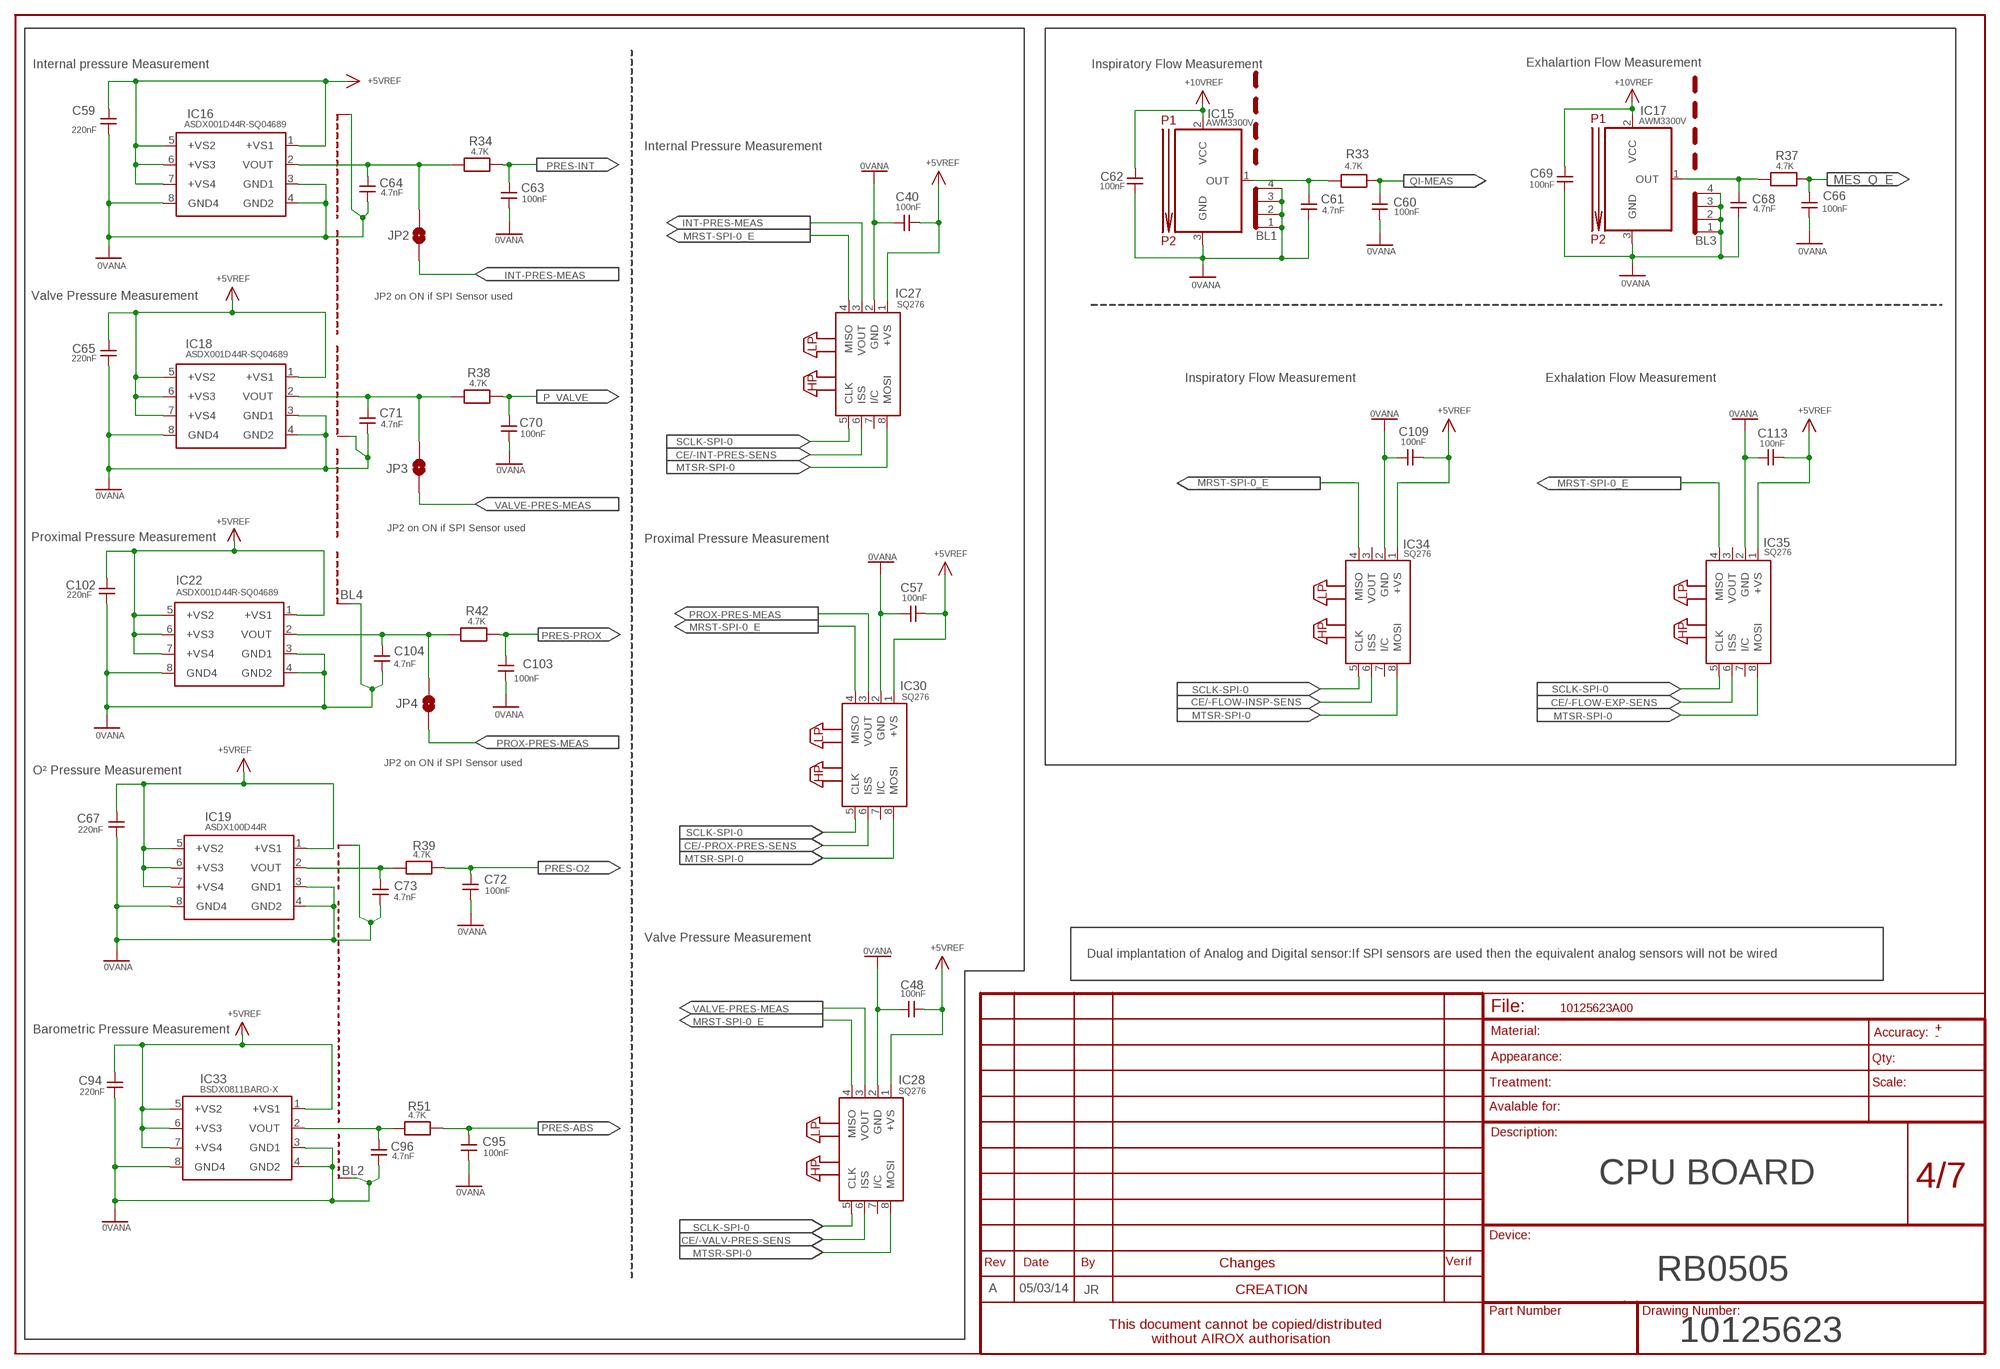
[diagram p3: schematic, sheet 4]

### Parts
BL1  BLIN-AWM33  [BLIN-AWM]
BL2  2XBL-AWM  [2XBL-AWM]
BL3  BLIN-AWM33  [BLIN-AWM]
BL4  3XBL-ADSX  [3XBL-AWM]
C40  100nF  C0805  [C0805]
C48  100nF  C0805  [C0805]
C57  100nF  C0805  [C0805]
C59  220nF  C1206  [C1206]
C60  100nF  C0805  [C0805]
C61  4.7nF  C0805  [C0805]
C62  100nF  C0805  [C0805]
C63  100nF  C0805  [C0805]
C64  4.7nF  C0805  [C0805]
C65  220nF  C1206  [C1206]
C66  100nF  C0805  [C0805]
C67  220nF  C1206  [C1206]
C68  4.7nF  C0805  [C0805]
C69  100nF  C0805  [C0805]
C70  100nF  C0805  [C0805]
C71  4.7nF  C0805  [C0805]
C72  100nF  C0805  [C0805]
C73  4.7nF  C0805  [C0805]
C94  220nF  C1206  [C1206]
C95  100nF  C0805  [C0805]
C96  4.7nF  C0805  [C0805]
C102  220nF  C1206  [C1206]
C103  100nF  C0805  [C0805]
C104  4.7nF  C0805  [C0805]
C109  100nF  C0805  [C0805]
C113  100nF  C0805  [C0805]
IC15  AWM3300V  [AWM3300V]
IC16  ASDX001D44R-SQ04689  ASDX  [ASDX]
IC17  AWM3300V  [AWM3300V]
IC18  ASDX001D44R-SQ04689  ASDX  [ASDX]
IC19  ASDX100D44R  ASDX  [ASDX]
IC22  ASDX001D44R-SQ04689  ASDX  [ASDX]
IC27  SQ276  [SQ276]
IC28  SQ276  [SQ276]
IC30  SQ276  [SQ276]
IC33  BSDX0811BARO-X  ASDX  [ASDX]
IC34  SQ276  [SQ276]
IC35  SQ276  [SQ276]
JP2  JUMP_0U  [0805]
JP3  JUMP_0U  [0805]
JP4  JUMP_0U  [0805]
R33  4.7K  R0805  [R0805]
R34  4.7K  R0805  [R0805]
R37  4.7K  R0805  [R0805]
R38  4.7K  R0805  [R0805]
R39  4.7K  R0805  [R0805]
R42  4.7K  R0805  [R0805]
R51  4.7K  R0805  [R0805]

### Nets
0VANA: BL1.1 BL1.2 BL1.3 BL1.4 BL2.1(OUT1) BL2.2(OUT2) BL3.1 BL3.2 BL3.3 BL3.4 BL4.1 BL4.3 BL4.4 C40.2 C48.2 C57.2 C59.1 C60.1 C61.1 C62.1 C63.1 C64.1 C65.1 C66.1 C67.1 C68.1 C69.1 C70.1 C71.1 C72.1 C73.1 C94.1 C95.1 C96.1 C102.1 C103.1 C104.1 C109.2 C113.2 IC15.3(GND) IC16.3(GND1) IC16.4(GND2) IC16.8(GND4) IC17.3(GND) IC18.3(GND1) IC18.4(GND2) IC18.8(GND4) IC19.3(GND1) IC19.4(GND2) IC19.8(GND4) IC22.3(GND1) IC22.4(GND2) IC22.8(GND4) IC27.2(GND) IC28.2(GND) IC30.2(GND) IC33.3(GND1) IC33.4(GND2) IC33.8(GND4) IC34.2(GND) IC35.2(GND) ; also sheet 1,3,5,6,7
+5VREF: C40.1 C48.1 C57.1 C59.2 C65.2 C67.2 C94.2 C102.2 C109.1 C113.1 IC16.1(+VS1) IC16.5(+VS2) IC16.6(+VS3) IC16.7(+VS4) IC18.1(+VS1) IC18.5(+VS2) IC18.6(+VS3) IC18.7(+VS4) IC19.1(+VS1) IC19.5(+VS2) IC19.6(+VS3) IC19.7(+VS4) IC22.1(+VS1) IC22.5(+VS2) IC22.6(+VS3) IC22.7(+VS4) IC27.1(+VS) IC28.1(+VS) IC30.1(+VS) IC33.1(+VS1) IC33.5(+VS2) IC33.6(+VS3) IC33.7(+VS4) IC34.1(+VS) IC35.1(+VS) ; also sheet 1,5,6
+10VREF: C62.2 C69.2 IC15.2(VCC) IC17.2(VCC) ; also sheet 5,6
CE/-FLOW-EXP-SENS: IC35.6(ISS) ; also sheet 2
CE/-FLOW-INSP-SENS: IC34.6(ISS) ; also sheet 2
CE/-INT-PRES-SENS: IC27.6(ISS) ; also sheet 2
CE/-PROX-PRES-SENS: IC30.6(ISS) ; also sheet 2
CE/-VALV-PRES-SENS: IC28.6(ISS) ; also sheet 2
INT-PRES-MEAS: IC27.3(VOUT) JP2.1
MES_Q_E: C66.2 R37.2 ; also sheet 1
MES_QI1: C61.2 IC15.1(OUT) R33.1
MES_QI4: C68.2 IC17.1(OUT) R37.1
MRST-SPI-0_E: IC27.4(MISO) IC28.4(MISO) IC30.4(MISO) IC34.4(MISO) IC35.4(MISO) ; also sheet 1,2,3
MTSR-SPI-0: IC27.8(MOSI) IC28.8(MOSI) IC30.8(MOSI) IC34.8(MOSI) IC35.8(MOSI) ; also sheet 1,2,3,7
N$21: C73.2 IC19.2(VOUT) R39.1
N$33: C64.2 IC16.2(VOUT) JP2.2 R34.1
N$36: C71.2 IC18.2(VOUT) JP3.2 R38.1
N$49: C104.2 IC22.2(VOUT) JP4.2 R42.1
N$51: C96.2 IC33.2(VOUT) R51.1
P_VALVE: C70.2 R38.2 ; also sheet 1
PRES-ABS: C95.2 R51.2 ; also sheet 1
PRES-INT: C63.2 R34.2 ; also sheet 1
PRES-O2: C72.2 R39.2 ; also sheet 1
PRES-PROX: C103.2 R42.2 ; also sheet 1
PROX-PRES-MEAS: IC30.3(VOUT) JP4.1
QI-MEAS: C60.2 R33.2 ; also sheet 1
SCLK-SPI-0: IC27.5(CLK) IC28.5(CLK) IC30.5(CLK) IC34.5(CLK) IC35.5(CLK) ; also sheet 1,2,3,7
VALVE-PRES-MEAS: IC28.3(VOUT) JP3.1
Unconnected: IC27.7(I/C) IC28.7(I/C) IC30.7(I/C) IC34.3(VOUT) IC34.7(I/C) IC35.3(VOUT) IC35.7(I/C)

### Notes on the sheet
- Internal pressure Measurement | Inspiratory Flow Measurement | Exhalartion Flow Measurement
- Internal Pressure Measurement
- Valve Pressure Measurement | JP2 on ON if SPI Sensor used
- Inspiratory Flow Measurement | Exhalation Flow Measurement
- JP2 on ON if SPI Sensor used
- Proximal Pressure Measurement | Proximal Pressure Measurement
- JP2 on ON if SPI Sensor used
- O² Pressure Measurement
- Valve Pressure Measurement
- Dual implantation of Analog and Digital sensor:If SPI sensors are used then the equivalent analog sensors will not be wired
- Barometric Pressure Measurement
- CPU BOARD
- RB0505
- A | 05/03/14 | JR
- 10125623

## Sheet 5 of 7
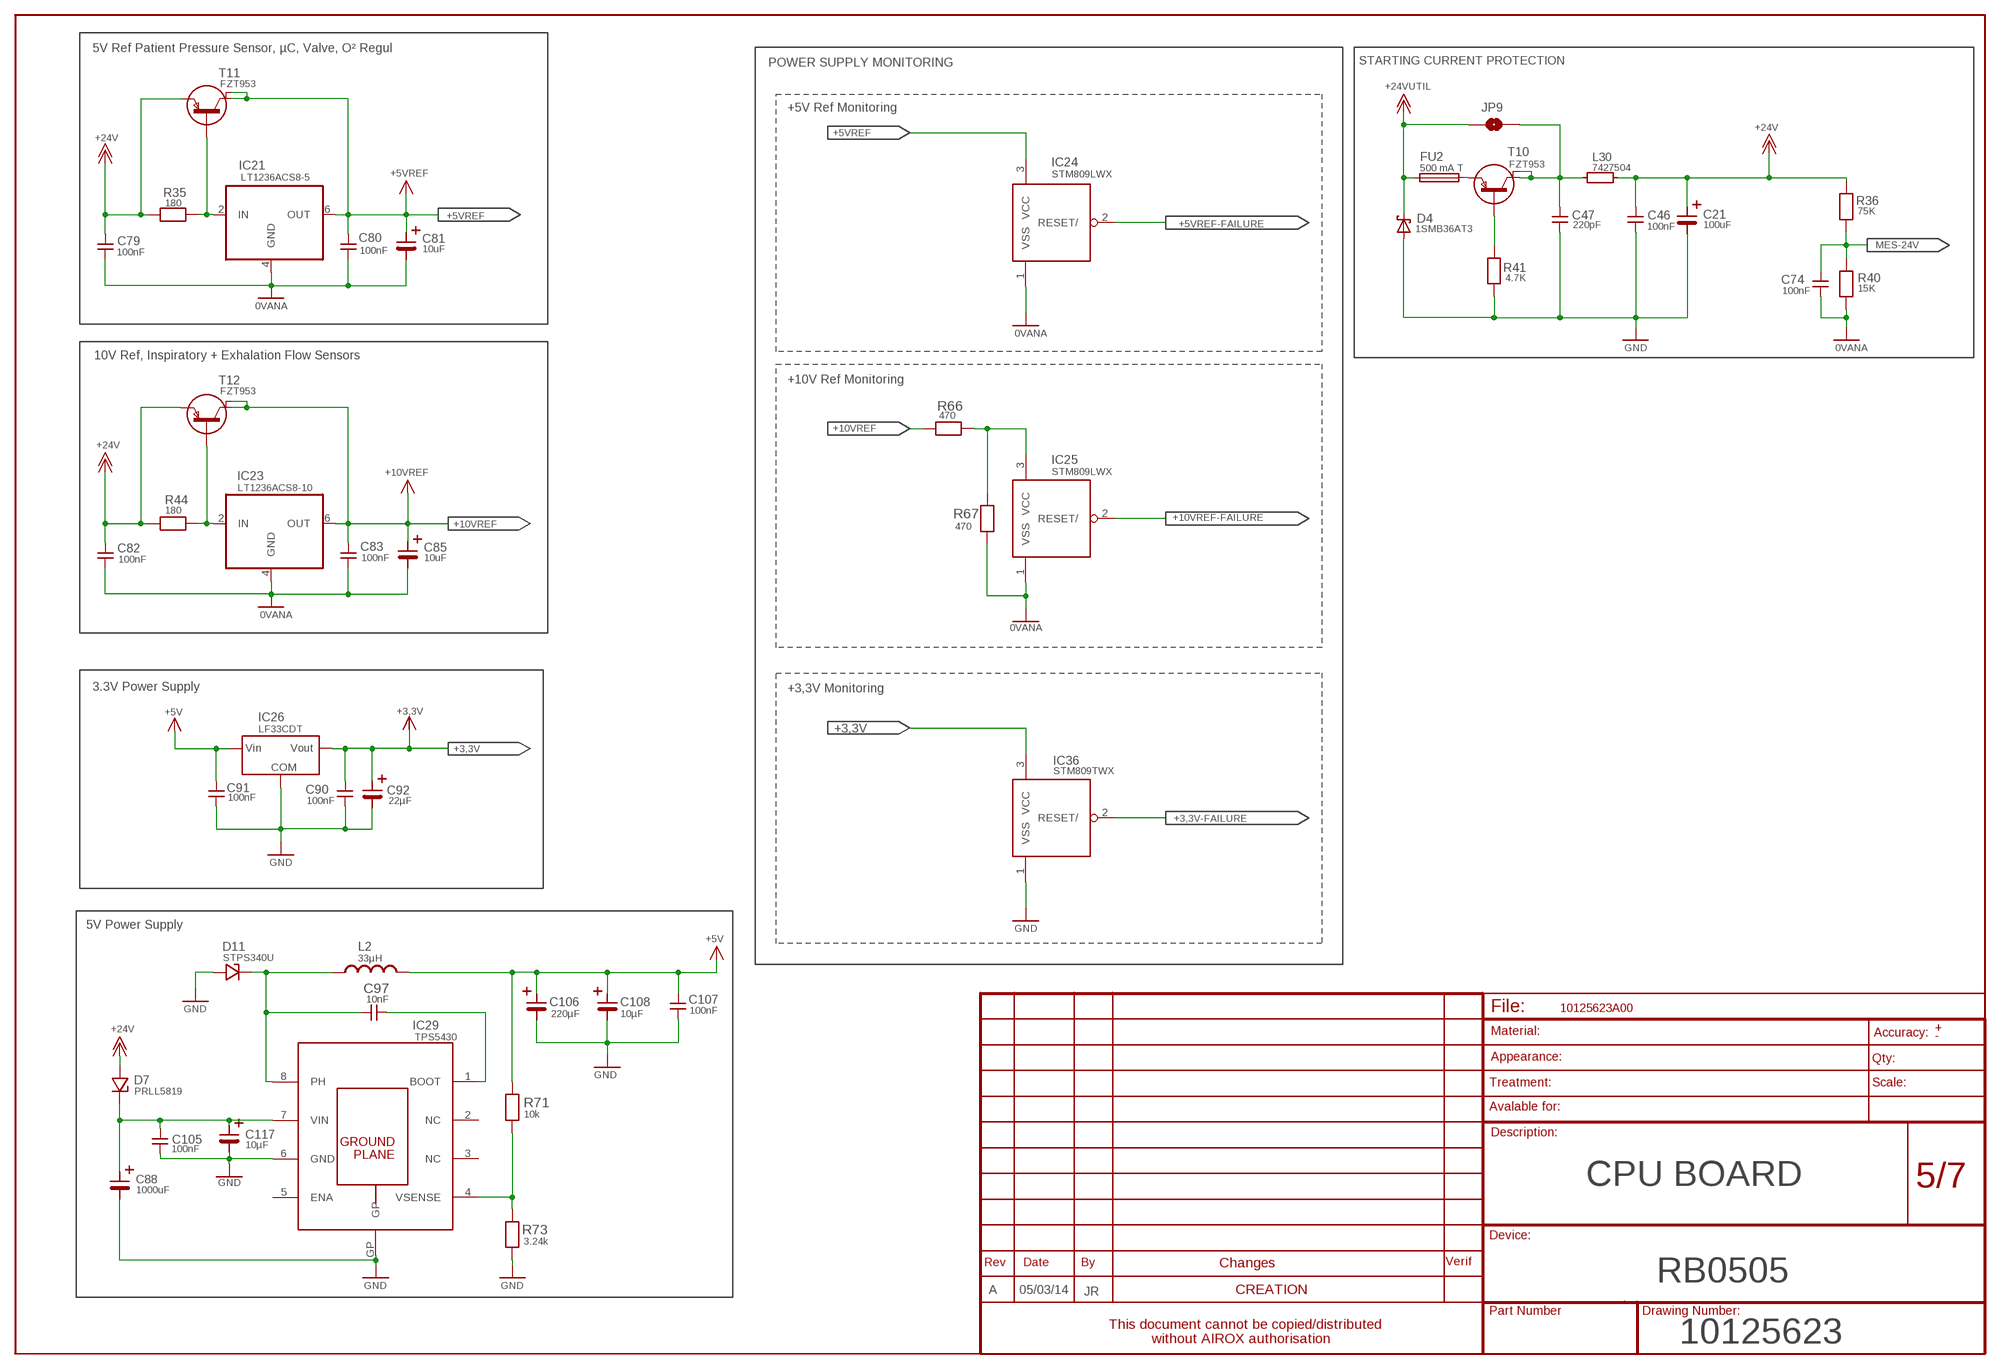
[diagram p4: schematic, sheet 5]

### Parts
C21  100uF  MV100F50V  [MV100?F]
C46  100nF  C0805  [C0805]
C47  220pF  C0805  [C0805]
C74  100nF  C0805  [C0805]
C79  100nF  C0805  [C0805]
C80  100nF  C0805  [C0805]
C81  10uF  TANTALD  [TANTALD]
C82  100nF  C0805  [C0805]
C83  100nF  C0805  [C0805]
C85  10uF  TANTALD  [TANTALD]
C88  1000uF  MV100F50V  [MV100?F]
C90  100nF  C0805  [C0805]
C91  100nF  C0805  [C0805]
C92  22µF  TANTALB  [TANTALB]
C97  10nF  C0805  [C0805]
C105  100nF  C0805  [C0805]
C106  220µF  CHCMS_D8  [CHCMS_D8]
C107  100nF  C0805  [C0805]
C108  10µF  TANTALB  [TANTALB]
C117  10µF  TANTALB  [TANTALB]
D4  1SMB36AT3  ICTE5  [C4111-15]
D7  PRLL5819  [SOD87]
D11  STPS340U  BAT54  [SOT23DIO]
FU2  500 mA T  SLOBLO  [SLOBLO]
IC21  LT1236ACS8-5  LT1236  [SO8]
IC23  LT1236ACS8-10  LT1236  [SO8]
IC24  STM809LWX  STM809  [SOT23]
IC25  STM809LWX  STM809  [SOT23]
IC26  LF33CDT  [REGUL-DPAK]
IC29  TPS5430  TPS5430DDA  [SO8POWERPAD]
IC36  STM809TWX  STM809  [SOT23]
JP9  JUMP_0U  [0805]
L2  33µH  WE-TPC-MH  [WE-TPC-MH]
L30  7427504  [PERL-FER]
R35  180  R0805  [R0805]
R36  75K  R0805  [R0805]
R40  15K  R0805  [R0805]
R41  4.7K  R1206  [R1206]
R44  180  R0805  [R0805]
R66  470  R0805  [R0805]
R67  470  R0805  [R0805]
R71  10k  R0805  [R0805]
R73  3.24k  R0805  [R0805]
T10  FZT953  BCP51  [SOT223]
T11  FZT953  BCP51  [SOT223]
T12  FZT953  BCP51  [SOT223]

### Nets
0VANA: C74.1 C79.1 C80.1 C81.- C82.1 C83.1 C85.- IC21.4(GND) IC23.4(GND) IC24.1(VSS) IC25.1(VSS) R40.2 R67.1 ; also sheet 1,3,4,6,7
+3,3V: C90.2 C92.+ IC26.OUTPUT(VOUT) IC36.3(VCC) ; also sheet 2,6,7
+3,3V-FAILURE: IC36.2(RESET/) ; also sheet 1
+5V: C91.2 C106.+ C107.2 C108.+ IC26.INPUT(VIN) L2.1 R71.1 ; also sheet 1,2,3,6,7
+5VREF: C80.2 C81.+ IC21.6(OUT) IC24.3(VCC) T11.2(C) T11.4(C2) ; also sheet 1,4,6
+5VREF-FAILURE: IC24.2(RESET/) ; also sheet 1
+10VREF: C83.2 C85.+ IC23.6(OUT) R66.1 T12.2(C) T12.4(C2) ; also sheet 4,6
+10VREF-FAILURE: IC25.2(RESET/) ; also sheet 1
+24V: C21.+ C46.2 C79.2 C82.2 D7.A L30.2 R35.1 R36.1 R44.1 T11.3(E) T12.3(E) ; also sheet 1,3,6,7
+24VUTIL: D4.K FU2.1 JP9.1 ; also sheet 7
GND: C21.- C46.1 C47.1 C88.- C90.1 C91.1 C92.- C105.1 C106.- C107.1 C108.- C117.- D4.A D11.1(A) IC26.GND(COM) IC29.6(GND) IC29.GP IC36.1(VSS) R41.1 R73.1 ; also sheet 1,2,3,6,7
MES-24V: C74.2 R36.2 R40.1 ; also sheet 1
N$19: IC21.2(IN) R35.2 T11.1(B)
N$26: IC23.2(IN) R44.2 T12.1(B)
N$28: IC29.4(VSENSE) R71.2 R73.2
N$30: C97.2 IC29.1(BOOT)
N$40: C88.+ C105.2 C117.+ D7.K IC29.7(VIN)
N$60: C97.1 D11.3(K) IC29.8(PH) L2.2
N$87: IC25.3(VCC) R66.2 R67.2
N$132: C47.2 JP9.2 L30.1 T10.2(C) T10.4(C2)
N$133: R41.2 T10.1(B)
N$135: FU2.2 T10.3(E)
Unconnected: IC29.2(NC) IC29.3(NC) IC29.5(ENA)

### Notes on the sheet
- 5V Ref Patient Pressure Sensor, µC, Valve, O² Regul
- POWER SUPPLY MONITORING | STARTING CURRENT PROTECTION
- +5V Ref Monitoring
- 10V Ref, Inspiratory + Exhalation Flow Sensors
- +10V Ref Monitoring
- 3.3V Power Supply | +3,3V Monitoring
- 5V Power Supply
- CPU BOARD
- RB0505
- A | 05/03/14 | JR
- 10125623

## Sheet 6 of 7
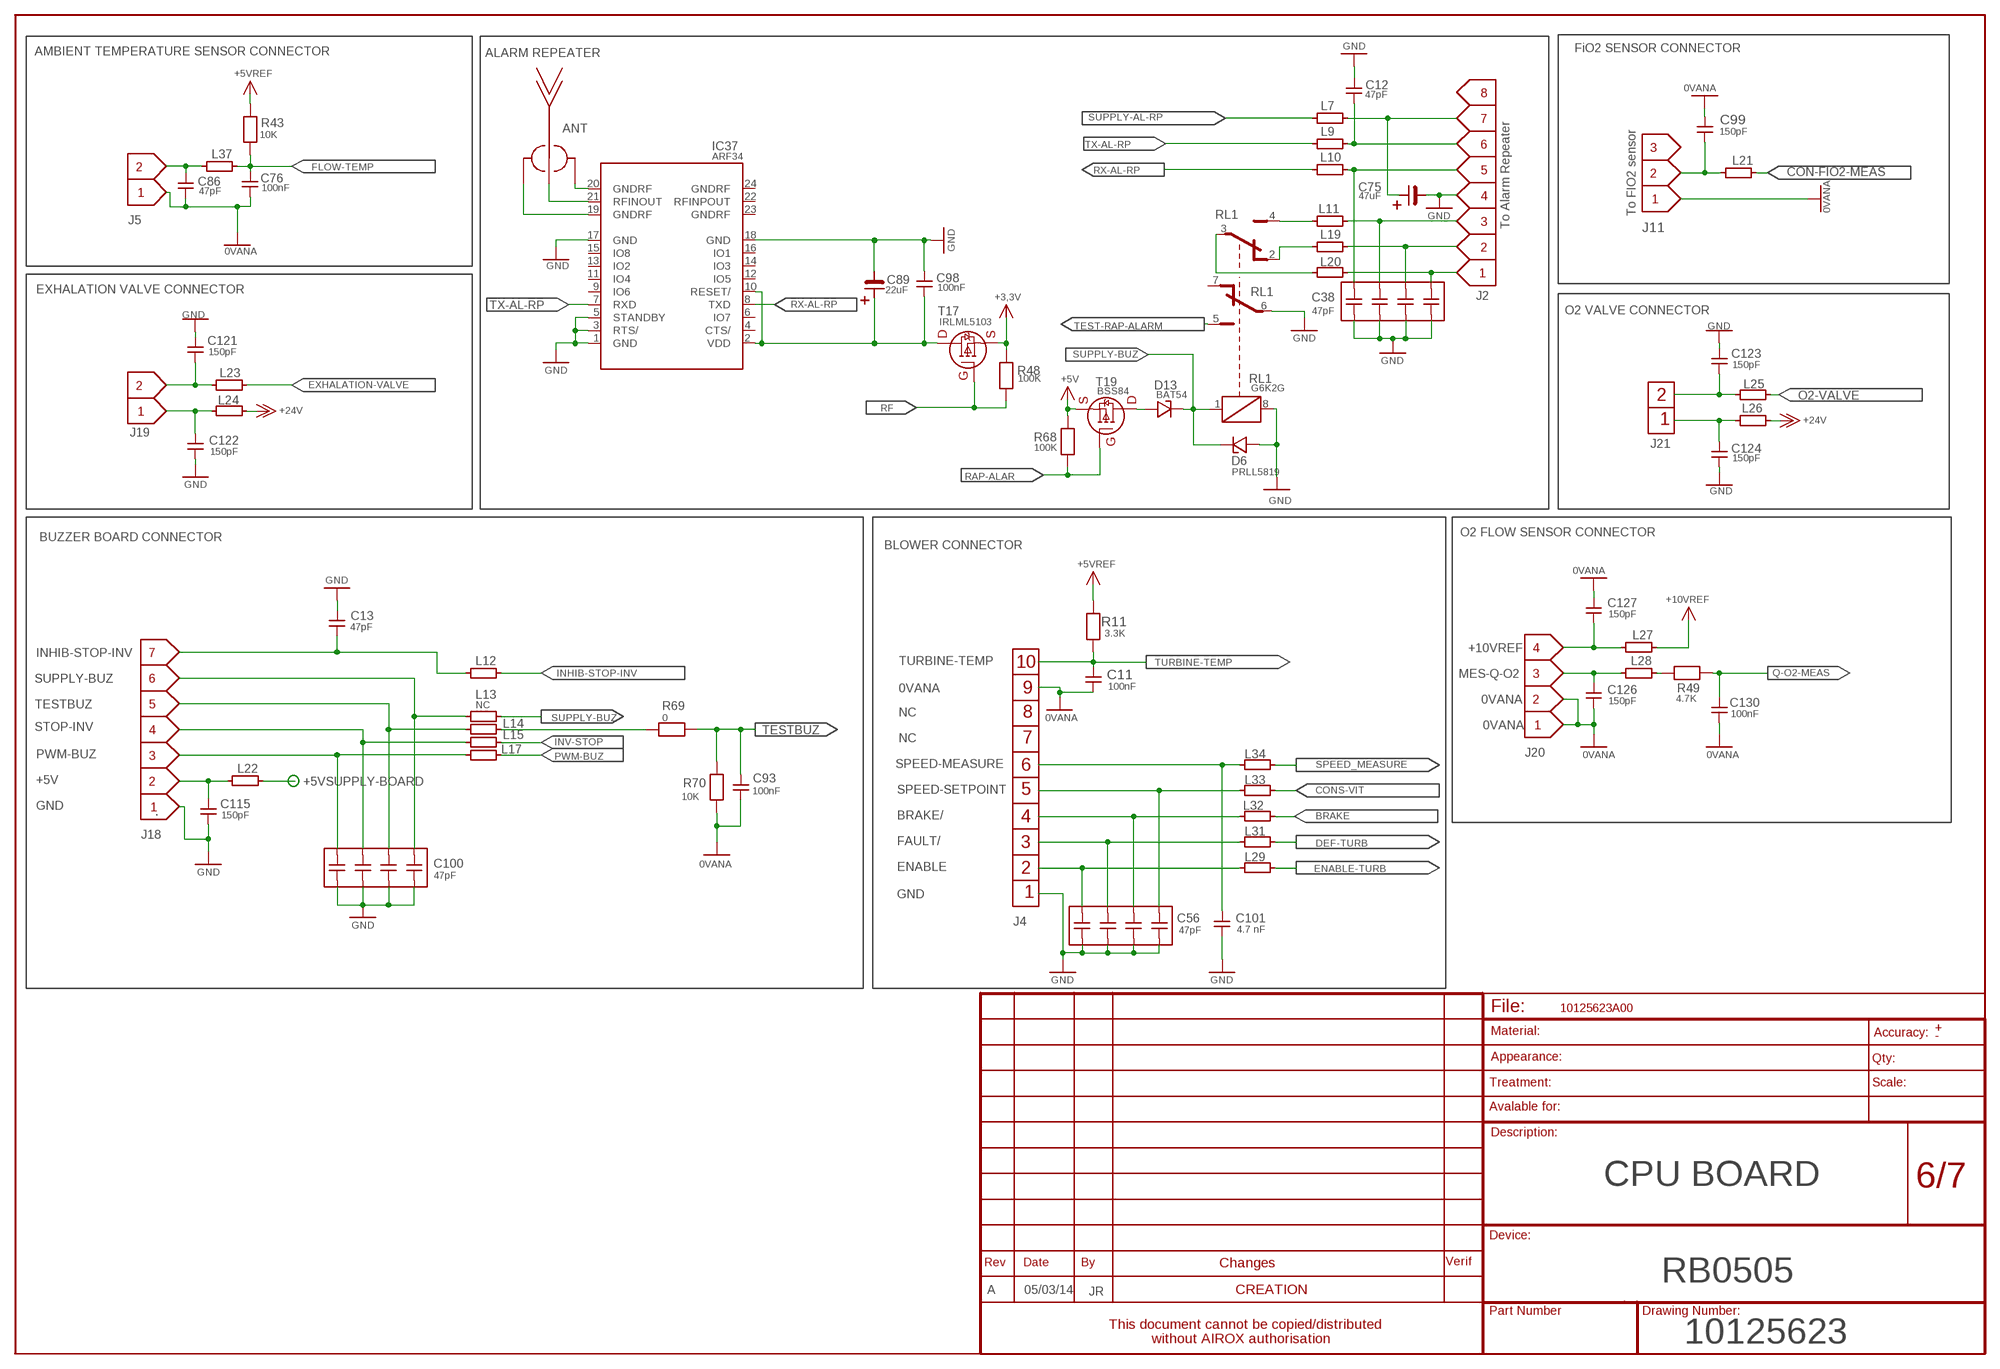
[diagram p5: schematic, sheet 6]

### Parts
ANT  ANTENNE  [ANTENNE]
C11  100nF  C0805  [C0805]
C12  47pF  C0603  [C0603]
C13  47pF  C0603  [C0603]
C38  47pF  RESEAU_4C  [RESEAU_1]
C56  47pF  RESEAU_4C  [RESEAU_1]
C75  47uF  TANTALB  [TANTALB]
C76  100nF  C0603  [C0603]
C86  47pF  C0805  [C0805]
C89  22uF  TANTALB  [TANTALB]
C93  100nF  C0805  [C0805]
C98  100nF  C0805  [C0805]
C99  150pF  C0603  [C0603]
C100  47pF  RESEAU_4C  [RESEAU_1]
C101  4.7 nF  C0805  [C0805]
C115  150pF  C0603  [C0603]
C121  150pF  C0603  [C0603]
C122  150pF  C0603  [C0603]
C123  150pF  C0603  [C0603]
C124  150pF  C0603  [C0603]
C126  150pF  C0603  [C0603]
C127  150pF  C0603  [C0603]
C130  100nF  C0805  [C0805]
D6  PRLL5819  [SOD87]
D13  BAT54  [SOT23DIO]
IC37  ARF34  [ARF34]
J2  B8B_ZR  [8BR]
J4  10BRMF  [MF10BR]
J5  B2B_ZR  [2BR]
J11  B3B_ZR  [3BR]
J18  B7B_ZR_SM3_TF  [7B_ZR_SM3_TF]
J19  B2B_ZR  [2BR]
J20  B4B_ZR  [4BR]
J21  2BR254C  [2BR254C]
L7  74279263  [0603]
L9  74279263  [0603]
L10  74279263  [0603]
L11  74279263  [0603]
L12  74279263  [0603]
L13  74279263  [0603]
L14  74279263  [0603]
L15  74279263  [0603]
L17  74279263  [0603]
L19  74279263  [0603]
L20  74279263  [0603]
L21  74279263  [0603]
L22  74279263  [0603]
L23  74279263  [0603]
L24  74279263  [0603]
L25  74279263  [0603]
L26  74279263  [0603]
L27  74279263  [0603]
L28  74279263  [0603]
L29  74279263  [0603]
L31  74279263  [0603]
L32  74279263  [0603]
L33  74279263  [0603]
L34  74279263  [0603]
L37  74279263  [0603]
R11  3.3K  R0805  [R0805]
R43  10K  R0805  [R0805]
R48  100K  R0805  [R0805]
R49  4.7K  R0805  [R0805]
R68  100K  R0805  [R0805]
R69  0  R0805  [R0805]
R70  10K  R0805  [R0805]
RL1  G6K2G  [G6K2G]
T17  IRLML5103  [SOT23MOS]
T19  BSS84  IRLML5103  [SOT23MOS]

### Nets
0VANA: C11.1 C76.1 C86.1 C93.1 C99.2 C126.1 C127.2 C130.1 J4.9 J5.1 J11.1 J20.1 J20.2 R70.1 ; also sheet 1,3,4,5,7
+3,3V: R48.1 T17.S ; also sheet 2,5,7
+5V: R68.2 T19.S ; also sheet 1,2,3,5,7
+5VREF: R11.2 R43.2 ; also sheet 1,4,5
+5VSUPPLY-BOARD: L22.2 ; also sheet 1,7
+10VREF: L27.2 ; also sheet 4,5
+24V: L24.2 L26.2 ; also sheet 1,3,5,7
BRAKE: L32.2 ; also sheet 1
BRAKE/: C56.6 J4.4 L32.1
C-RAP-AL: L20.2 RL1.3(L)
CON-FIO2-MEAS: L21.2 ; also sheet 3
CONS-VIT: L33.2 ; also sheet 1
DEF-TURB: L31.2 ; also sheet 1
ENABLE: C56.8 J4.2 L29.1
ENABLE-TURB: L29.2 ; also sheet 1
EXHALATION-VALVE: L23.2 ; also sheet 3
FAULT/: C56.7 J4.3 L31.1
FLOW-TEMP: C76.2 L37.2 R43.1 ; also sheet 1
GND: C12.2 C13.2 C38.1 C38.2 C38.3 C38.4 C56.1 C56.2 C56.3 C56.4 C75.- C89.- C98.2 C100.1 C100.2 C100.3 C100.4 C101.1 C115.1 C121.2 C122.1 C123.2 C124.1 D6.A IC37.1(GND) IC37.3(RTS/) IC37.5(STANDBY) IC37.17(GND) IC37.18(GND) J2.4 J4.1 J18.1 RL1.6(L) RL1.8(B1-) ; also sheet 1,2,3,5,7
INHIB-STOP-INV: L12.2 ; also sheet 7
INV-STOP: L15.2 ; also sheet 1
N$2: C75.+ J2.7 L7.1
N$23: C86.2 J5.2 L37.1
N$42: C38.6 J2.3 L11.1
N$43: C38.7 J2.2 L19.1
N$44: C38.8 J2.1 L20.1
N$48: L14.2 R69.1
N$52: C99.1 J11.2 L21.1
N$54: ANT.2 IC37.20(GNDRF)
N$58: ANT.1 IC37.21(RFINOUT)
N$61: C12.1 J2.6 L9.1
N$62: C38.5 J2.5 L10.1
N$70: C115.2 J18.2 L22.1
N$71: C100.7 J18.4 L15.1
N$72: C100.6 J18.5 L14.1
N$75: C100.5 J18.6 L13.1
N$78: ANT.3 IC37.19(GNDRF)
N$81: C89.+ C98.1 IC37.2(VDD) IC37.10(RESET/) T17.D
N$83: C13.1 J18.7 L12.1
N$127: C100.8 J18.3 L17.1
N$128: D13.1(A) T19.D
N$136: C121.1 J19.2 L23.1
N$137: C122.2 J19.1 L24.1
N$138: C123.1 J21.2 L25.1
N$139: C124.2 J21.1 L26.1
N$140: C127.1 J20.4 L27.1
N$141: C126.2 J20.3 L28.1
N$142: L28.2 R49.1
O2-VALVE: L25.2 ; also sheet 3
PWM-BUZ: L17.2 ; also sheet 1
Q-O2-MEAS: C130.2 R49.2 ; also sheet 1
R-RAP-AL: L19.2 RL1.2(R)
RAP-ALAR: R68.1 T19.G ; also sheet 1
RF: R48.2 T17.G ; also sheet 1
RX-AL-RP: IC37.8(TXD) L10.2 ; also sheet 2
SPEED-MEASURE: C101.2 J4.6 L34.1
SPEED-SETPOINT: C56.5 J4.5 L33.1
SPEED_MEASURE: L34.2 ; also sheet 1
SUPPLY-AL-RP: L7.2 ; also sheet 2
SUPPLY-BUZ: D6.K D13.3(K) L13.2 RL1.1(B2+)
T-RAP-AL: L11.2 RL1.4(T)
TEST-RAP-ALARM: RL1.5(T) ; also sheet 1
TESTBUZ: C93.2 R69.2 R70.2 ; also sheet 1
TURBINE-TEMP: C11.2 J4.10 R11.1 ; also sheet 1
TX-AL-RP: IC37.7(RXD) L9.2 ; also sheet 2
Unconnected: IC37.4(CTS/) IC37.6(IO7) IC37.9(IO6) IC37.11(IO4) IC37.12(IO5) IC37.13(IO2) IC37.14(IO3) IC37.15(IO8) IC37.16(IO1) IC37.22(RFINPOUT) IC37.23(GNDRF) IC37.24(GNDRF) J2.8 J4.7 J4.8 J11.3 RL1.7(R)

### Notes on the sheet
- AMBIENT TEMPERATURE SENSOR CONNECTOR | FiO2 SENSOR CONNECTOR
- ALARM REPEATER
- To FIO2 sensor
- To Alarm Repeater
- EXHALATION VALVE CONNECTOR
- O2 VALVE CONNECTOR
- O2 FLOW SENSOR CONNECTOR
- BUZZER BOARD CONNECTOR
- BLOWER CONNECTOR
- +10VREF
- INHIB-STOP-INV
- MES-Q-O2
- SUPPLY-BUZ
- 0VANA
- TESTBUZ | NC
- NC
- STOP-INV | 0VANA
- NC
- PWM-BUZ
- +5V
- GND
- GND
- CPU BOARD
- RB0505
- A | 05/03/14 | JR
- 10125623

## Sheet 7 of 7
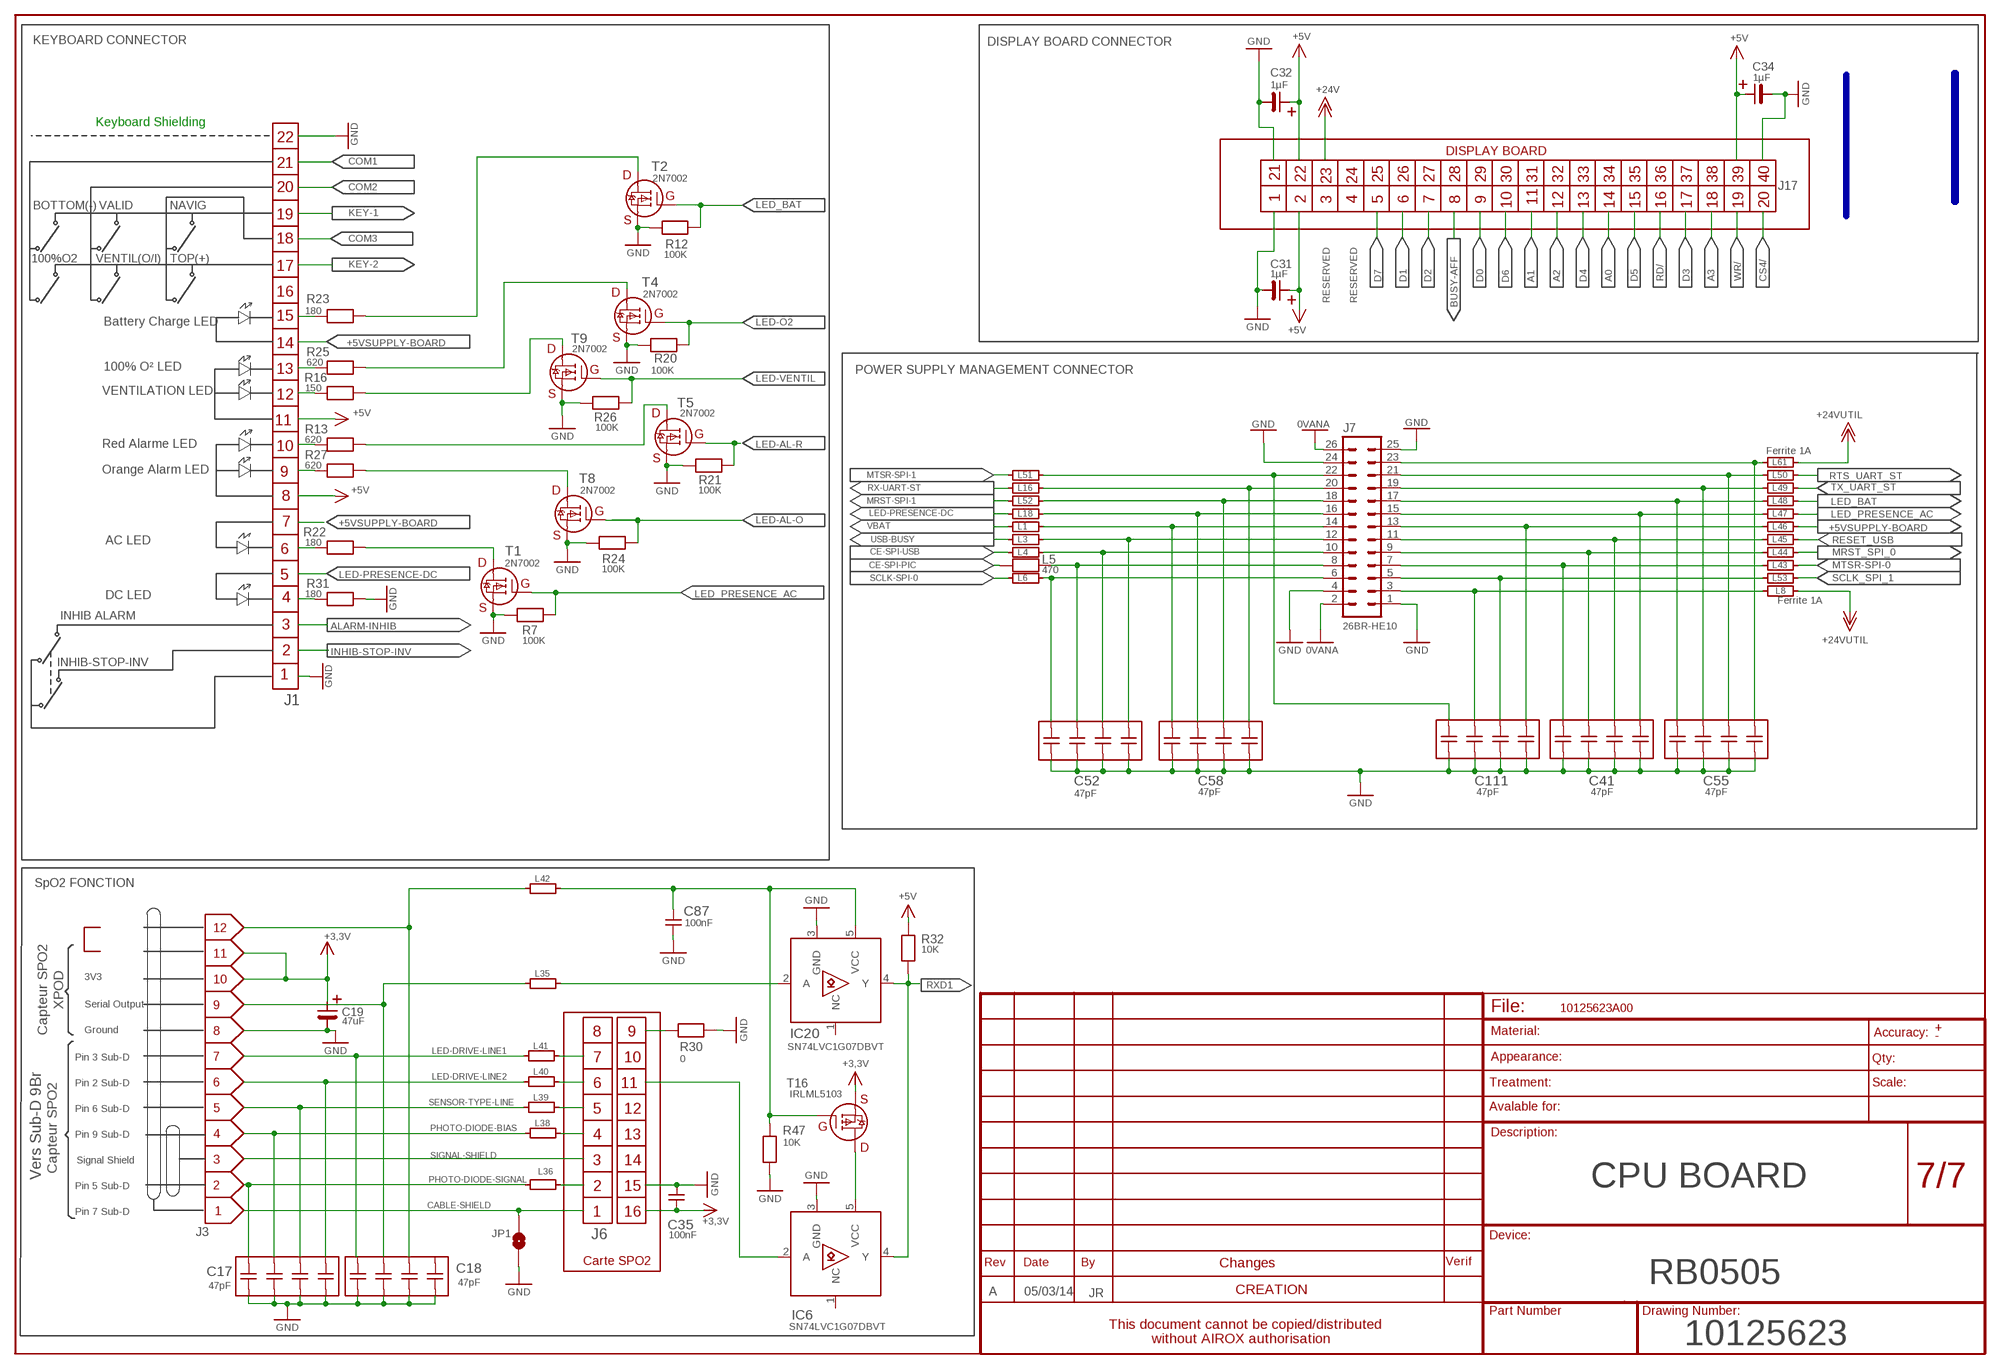
[diagram p6: schematic, sheet 7]

### Parts
C17  47pF  RESEAU_4C  [RESEAU_1]
C18  47pF  RESEAU_4C  [RESEAU_1]
C19  47uF  TANTALB  [TANTALB]
C31  1µF  TANTALB  [TANTALB]
C32  1µF  TANTALB  [TANTALB]
C34  1µF  TANTALB  [TANTALB]
C35  100nF  C0805  [C0805]
C41  47pF  RESEAU_4C  [RESEAU_1]
C52  47pF  RESEAU_4C  [RESEAU_1]
C55  47pF  RESEAU_4C  [RESEAU_1]
C58  47pF  RESEAU_4C  [RESEAU_1]
C87  100nF  C0603  [C0603]
C111  47pF  RESEAU_4C  [RESEAU_1]
IC6  SN74LVC1G07DBVT  LVC1G07DBVT  [SOT753_DBV]
IC20  SN74LVC1G07DBVT  LVC1G07DBVT  [SOT753_DBV]
J1  ZIF-52610-2290  [ZIF-52610-2290]
J3  B12B-ZR  [12BR]
J6  87606-408  [2X16BR]
J7  26BR-HE10  [26BR-HE10]
J17  FH_40BR  [FH_SERIE]
JP1  JUMP_0U  [0805]
L1  Ferrite 200mA  74279263  [0603]
L3  Ferrite 200mA  74279263  [0603]
L4  Ferrite 200mA  74279263  [0603]
L5  470  R0805  [R0805]
L6  Ferrite 200mA  74279263  [0603]
L8  Ferrite 1A  7427504  [PERL-FER]
L16  Ferrite 200mA  74279263  [0603]
L18  Ferrite 200mA  74279263  [0603]
L35  Ferrite 200mA  74279263  [0603]
L36  Ferrite 200mA  74279263  [0603]
L38  Ferrite 200mA  74279263  [0603]
L39  Ferrite 200mA  74279263  [0603]
L40  Ferrite 200mA  74279263  [0603]
L41  Ferrite 200mA  74279263  [0603]
L42  Ferrite 200mA  74279263  [0603]
L43  Ferrite 200mA  74279263  [0603]
L44  Ferrite 200mA  74279263  [0603]
L45  Ferrite 200mA  74279263  [0603]
L46  Ferrite 200mA  74279263  [0603]
L47  Ferrite 200mA  74279263  [0603]
L48  Ferrite 200mA  74279263  [0603]
L49  Ferrite 200mA  74279263  [0603]
L50  Ferrite 200mA  74279263  [0603]
L51  Ferrite 200mA  74279263  [0603]
L52  Ferrite 200mA  74279263  [0603]
L53  Ferrite 200mA  74279263  [0603]
L61  Ferrite 1A  7427504  [PERL-FER]
R7  100K  R0805  [R0805]
R12  100K  R0805  [R0805]
R13  620  R0805  [R0805]
R16  150  R1206  [R1206]
R20  100K  R0805  [R0805]
R21  100K  R0805  [R0805]
R22  180  R1206  [R1206]
R23  180  R1206  [R1206]
R24  100K  R0805  [R0805]
R25  620  R0805  [R0805]
R26  100K  R0805  [R0805]
R27  620  R0805  [R0805]
R30  0  R0805  [R0805]
R31  180  R1206  [R1206]
R32  10K  R0805  [R0805]
R47  10K  R0805  [R0805]
T1  2N7002  IRLML2803  [SOT23MOS]
T2  2N7002  IRLML2803  [SOT23MOS]
T4  2N7002  IRLML2803  [SOT23MOS]
T5  2N7002  IRLML2803  [SOT23MOS]
T8  2N7002  IRLML2803@2  [SOT23MOS]
T9  2N7002  IRLML2803@2  [SOT23MOS]
T16  IRLML5103  [SOT23MOS]

### Nets
0VANA: J7.2 J7.26 ; also sheet 1,3,4,5,6
+3,3V: C19.+ C35.1 J3.10 J3.11 J6.16 T16.S ; also sheet 2,5,6
+5V: C31.+ C32.+ C34.+ J1.8B J1.11B J17.2 J17.22 J17.39 R32.2 ; also sheet 1,2,3,5,6
+5VSUPPLY-BOARD: J1.7B J1.14B L46.2 ; also sheet 1,6
+24V: J17.23 ; also sheet 1,3,5,6
+24VUTIL: L8.2 L61.2 ; also sheet 5
A0: J17.14 ; also sheet 1,2
A1: J17.11 ; also sheet 1,2
A2: J17.12 ; also sheet 1,2
A3: J17.18 ; also sheet 1,2
ALARM-INHIB: J1.3B ; also sheet 1
BUSY-AFF: J17.8 ; also sheet 1
CABLE-SHIELD: J3.1 J6.1 JP1.2
CE-SPI-PIC: L5.1 ; also sheet 2
CE-SPI-USB: L4.1 ; also sheet 2
COM1: J1.21B ; also sheet 1
COM2: J1.20B ; also sheet 1
COM3: J1.18B ; also sheet 1
CS4/: J17.20 ; also sheet 1
D0: J17.9 ; also sheet 1,2
D1: J17.6 ; also sheet 1,2
D2: J17.7 ; also sheet 1,2
D3: J17.17 ; also sheet 1,2
D4: J17.13 ; also sheet 1,2
D5: J17.15 ; also sheet 1,2
D6: J17.10 ; also sheet 1,2
D7: J17.5 ; also sheet 1,2
GND: C17.1 C17.2 C17.3 C17.4 C18.1 C18.2 C18.3 C18.4 C19.- C31.- C32.- C34.- C35.2 C41.1 C41.2 C41.3 C41.4 C52.1 C52.2 C52.3 C52.4 C55.1 C55.2 C55.3 C55.4 C58.1 C58.2 C58.3 C58.4 C87.1 C111.1 C111.2 C111.3 C111.4 IC6.3(GND) IC20.3(GND) J1.1B J1.22B J3.8 J6.15 J7.1 J7.4 J7.24 J7.25 J17.1 J17.21 J17.40 JP1.1 R7.2 R12.2 R20.2 R21.2 R24.2 R26.2 R30.1 R31.2 R47.1 T1.S T2.S T4.S T5.S T8.S T9.S ; also sheet 1,2,3,5,6
INHIB-STOP-INV: J1.2B ; also sheet 6
KEY-1: J1.19B ; also sheet 1
KEY-2: J1.17B ; also sheet 1
LED-AL-O: R24.1 T8.G ; also sheet 1
LED-AL-R: R21.1 T5.G ; also sheet 1
LED-DRIVE-LINE1: C18.8 J3.7 L41.1
LED-DRIVE-LINE2: C17.5 J3.6 L40.1
LED-O2: R20.1 T4.G ; also sheet 2
LED-PRESENCE-DC: J1.5B L18.1
LED-VENTIL: R26.1 T9.G ; also sheet 2
LED_BAT: L48.2 R12.1 T2.G
LED_PRESENCE_AC: L47.2 R7.1 T1.G ; also sheet 1
MRST-SPI-1: L52.1 ; also sheet 1
MRST_SPI_0: L44.2 ; also sheet 1
MTSR-SPI-0: L43.2 ; also sheet 1,2,3,4
MTSR-SPI-1: L51.1 ; also sheet 1
N$1: J1.6B R22.1
N$5: R22.2 T1.D
N$7: J1.15B R23.1
N$15: IC6.2(A) J6.11
N$17: J6.2 L36.2
N$18: J6.4 L38.2
N$22: J6.5 L39.2
N$24: C87.2 IC20.5(VCC) L42.2 R47.2 T16.G
N$25: J6.6 L40.2
N$37: J6.7 L41.2
N$38: IC6.5(VCC) T16.D
N$39: IC20.2(A) L35.2
N$46: C41.8 J7.7 L43.1
N$47: C18.6 J3.12 L42.1
N$50: J1.4B R31.1
N$59: R23.2 T2.D
N$93: C111.5 J7.13 L46.1
N$97: J1.10B R13.1
N$98: J1.9B R27.1
N$103: C111.8 J7.22 L51.2
N$104: C58.6 J7.18 L52.2
N$105: C111.6 J7.5 L53.1
N$112: C111.7 J7.3 L8.1
N$113: C58.5 J7.20 L16.2
N$115: J1.12B R16.1
N$117: J1.13B R25.1
N$118: R13.2 T5.D
N$122: R27.2 T8.D
N$123: R16.2 T9.D
N$129: R25.2 T4.D
N$526: C55.5 J7.23 L61.1
N$620: C52.8 J7.6 L6.2
N$622: C52.7 J7.8 L5.2
N$623: C41.7 J7.9 L44.1
N$624: C52.6 J7.10 L4.2
N$625: C41.6 J7.11 L45.1
N$626: C52.5 J7.12 L3.2
N$628: C58.8 J7.14 L1.2
N$629: C41.5 J7.15 L47.1
N$630: C58.7 J7.16 L18.2
N$631: C55.8 J7.17 L48.1
N$633: C55.7 J7.19 L49.1
N$635: C55.6 J7.21 L50.1
PHOTO-DIODE-BIAS: C17.7 J3.4 L38.1
PHOTO-DIODE-SIGNAL: C17.8 J3.2 L36.1
RD/: J17.16 ; also sheet 1,2
RESET_USB: L45.2 ; also sheet 1
RTS_UART_ST: L50.2 ; also sheet 1
RX-UART-ST: L16.1 ; also sheet 1
RXD1: IC6.4(Y) IC20.4(Y) R32.1 ; also sheet 1
SCLK-SPI-0: L6.1 ; also sheet 1,2,3,4
SCLK_SPI_1: L53.2 ; also sheet 1
SENSOR-TYPE-LINE: C17.6 J3.5 L39.1
SIGNAL-SHIELD: J3.3 J6.3
SPO2-SERIAL-DATA-FORMAT: J6.9 R30.2
SPO2-SERIAL-OUT: C18.7 J3.9 L35.1
TX_UART_ST: L49.2 ; also sheet 1
USB-BUSY: L3.1 ; also sheet 1
VBAT: L1.1 ; also sheet 1
WR/: J17.19 ; also sheet 1,2
Unconnected: C18.5 IC6.1(NC) IC20.1(NC) J1.1 J1.2 J1.3 J1.4 J1.5 J1.6 J1.7 J1.8 J1.9 J1.10 J1.11 J1.12 J1.13 J1.14 J1.15 J1.16 J1.16B J1.17 J1.18 J1.19 J1.20 J1.21 J1.22 J6.8 J6.10 J6.12 J6.13 J6.14 J17.3 J17.4 J17.24 J17.25 J17.26 J17.27 J17.28 J17.29 J17.30 J17.31 J17.32 J17.33 J17.34 J17.35 J17.36 J17.37 J17.38

### Buses
D[0..15]
A[0..23]

### Notes on the sheet
- KEYBOARD CONNECTOR | DISPLAY BOARD CONNECTOR
- Keyboard Shielding
- DISPLAY BOARD
- BOTTOM(-) | VALID | NAVIG
- 100%O2 | VENTIL(O/I) | TOP(+)
- RESERVED | RESERVED
- Battery Charge LED
- 100% O² LED | POWER SUPPLY MANAGEMENT CONNECTOR
- VENTILATION LED
- Red Alarme LED
- Orange Alarm LED
- AC LED
- DC LED
- INHIB ALARM
- INHIB-STOP-INV
- SpO2 FONCTION
- 3V3
- XPOD | Serial Output
- Capteur SPO2 | Ground
- Pin 3 Sub-D
- Pin 2 Sub-D
- Pin 6 Sub-D
- Pin 9 Sub-D
- Signal Shield
- Capteur SPO2
- Vers Sub-D 9Br
- Pin 5 Sub-D | CPU BOARD
- Pin 7 Sub-D
- Carte SPO2
- RB0505
- A | 05/03/14 | JR
- 10125623

## Library data of the parts
ANT = CI2:ANTENNE
BL1 BL3 = Capteur:BLIN-AWM33
BL2 = Capteur:2XBL-AWM
BL4 = Capteur:3XBL-ADSX
BUZ1 = BUZZER:F/HMB
C1 C3 C5 C12 C13 C20 C76 C87 C112 C114 = CONDENSAT_CMS:C0603
C2 C10 C22-C30 C40 C42 C48-C50 C53 C54 C57 C60-C64 C66 C68-C73 C78-C80 C82-C84 C95 C96 C103 C104 C109 C113 C120 = CONDENSA:C0805
C4 C6 C9 C11 C15 C16 C33 C35-C37 C39 C43 C45-C47 C51 C74 C77 C86 C90 C91 C93 C97 C98 C101 C105 C107 C110 C116 C130 C140 = CONDENSAT_CMS:C0805
C7 C8 C19 C75 C89 C92 C108 C117 = CONDENSAT_CMS:TANTALB
C14 = CONDENSAT_CMS:RES_4CB
C17 C18 C38 C41 C52 C55 C56 C58 C100 C111 = CONDENSAT_CMS:RESEAU_4C
C21 C88 = CONDENSA@5:MV100?F50V
C31 C32 C34 = CONDENSA:TANTALB
C44 = CONDENSA@2:C0805
C59 C65 C67 C94 C102 = CONDENSA:C1206
C81 C85 = CONDENSA@3:TANTALD
C99 C115 C121-C124 C126 C127 = CONDENSA:C0603
C106 = CONDENSAT_CMS:CHCMS_D8
D1-D3 D5 = TRANSIST_DIOD_CMS:NUR30
D4 = DIODE:ICTE5
D6 D15 D16 = TRANSIST:PRLL5819
D7 = TRANSIST_DIOD_CMS:PRLL5819
D8 D12 = TRANSIST_DIOD_CMS:BZX84CXX
D9-D11 D13 = TRANSIST_DIOD_CMS:BAT54
D14 = TRANSIST_DIOD_CMS:BAT54C
FU2 = fuse:SLOBLO
G1 = battery:KEY_3000
IC1 = CI2:TL16C750IPM
IC2 = CI2:SN74ALVC164245
IC3 = CI2:K6R4016C1DTCT000(256KX16)
IC4 = CI2:ST10F269-273-276
IC5 IC42 IC43 = CI2:74HCT1G32GW
IC6 IC8 IC9 IC20 = CI2:LVC1G07DBVT
IC7 = CI2:29F800
IC10 = MAXIM@2:DS1305E
IC11 = CI_ANAL:LM358
IC12 = MAXIM:MAX690ACSA
IC13 = CI2:K9F4G08U0M-PCB000
IC14 = CI2:74ACT16373
IC15 IC17 = Capteur:AWM3300V
IC16 IC18 IC19 IC22 IC33 = Capteur:ASDX
IC21 IC23 = LINEAR@2:LT1236
IC24 IC25 IC36 = CI2:STM809
IC26 = CI2:LF33CDT
IC27 IC28 IC30 IC34 IC35 = Capteur:SQ276
IC29 = CI2:TPS5430DDA
IC31 = st-microelectronics:M41T94MQ6E
IC32 = MEMORY:AT25---
IC37 = CI2:ARF34
IC38 = CI2:74HCT1G08GW
IC39 IC41 = CI2:74HCT1G04GW
IC40 = CI2:CD74HCT245M
IC44 = CI2:NC7SZ66
J1 = Connecteur_cms:ZIF-52610-2290
J2 = Connecteur_cms:B8B_ZR
J3 = Connecteur_cms:B12B-ZR
J4 = Connecteur:10BRMF
J5 J19 = Connecteur_cms:B2B_ZR
J6 = Connecteur:87606-408
J7 = Connecteur:26BR-HE10
J11 = Connecte:B3B_ZR
J17 = Connecteur_cms:FH_40BR
J18 = Connecteur_cms:B7B_ZR_SM3_TF
J20 = Connecte:B4B_ZR
J21 = Connecte:2BR254C
JP1-JP9 = JUMPER:JUMP_0U
JPL1 = SUPPLY:LIAISON_MASSES
L1 L3 L4 L6 L7 L9-L29 L31-L53 = FILTRE:74279263
L2 = SELF:WE-TPC-MH
L5 R1 R3 R10 R11 R14 R15 R30 R35 R36 R40 R43-R46 R48 R52-R56 R60-R62 R66-R73 = RESIST_CMS:R0805
L8 L30 L61 = FILTRE:7427504
PST1 PST3 PST4 PST6 = PINHEAD:PAST01
PT1 PT2 = PINHEAD:PINHD-1X1
Q1 = QUARTZ:SM49
Q2 = QUARTZ:HC49UP
Q3 Q5 = QUARTZ:86SMX
R2 R4-R9 R12 R13 R17-R21 R24-R29 R32-R34 R37-R39 R42 R47 R49 R51 R57-R59 R65 = RESIST_C:R0805
R16 R22 R23 R31 = RESIST_C@2:R1206
R41 = RESIST_CMS:R1206
RL1 = RELAIS1:G6K2G
RS1 RS6-RS8 = RESIST_CMS:RES_4R_BCN
RS2-RS5 = RESIST_C:RES_4R_BCN
T1 T2 T4 T5 = TRANSIST:IRLML2803
T3 T16 T17 T19 = TRANSIST_DIOD_CMS:IRLML5103
T6 = TRANSIST_DIOD_CMS:2N7002
T8 T9 = TRANSIST:IRLML2803@2
T10-T12 = TRANSIST_DIOD_CMS:BCP51
T14 T20 T21 = TRANSIST:MTD3055
V2 = Vanne:FAS-PPS-1P-3NIP-INJ